# EAGLE design GPU (EAGLE 9.3.2)
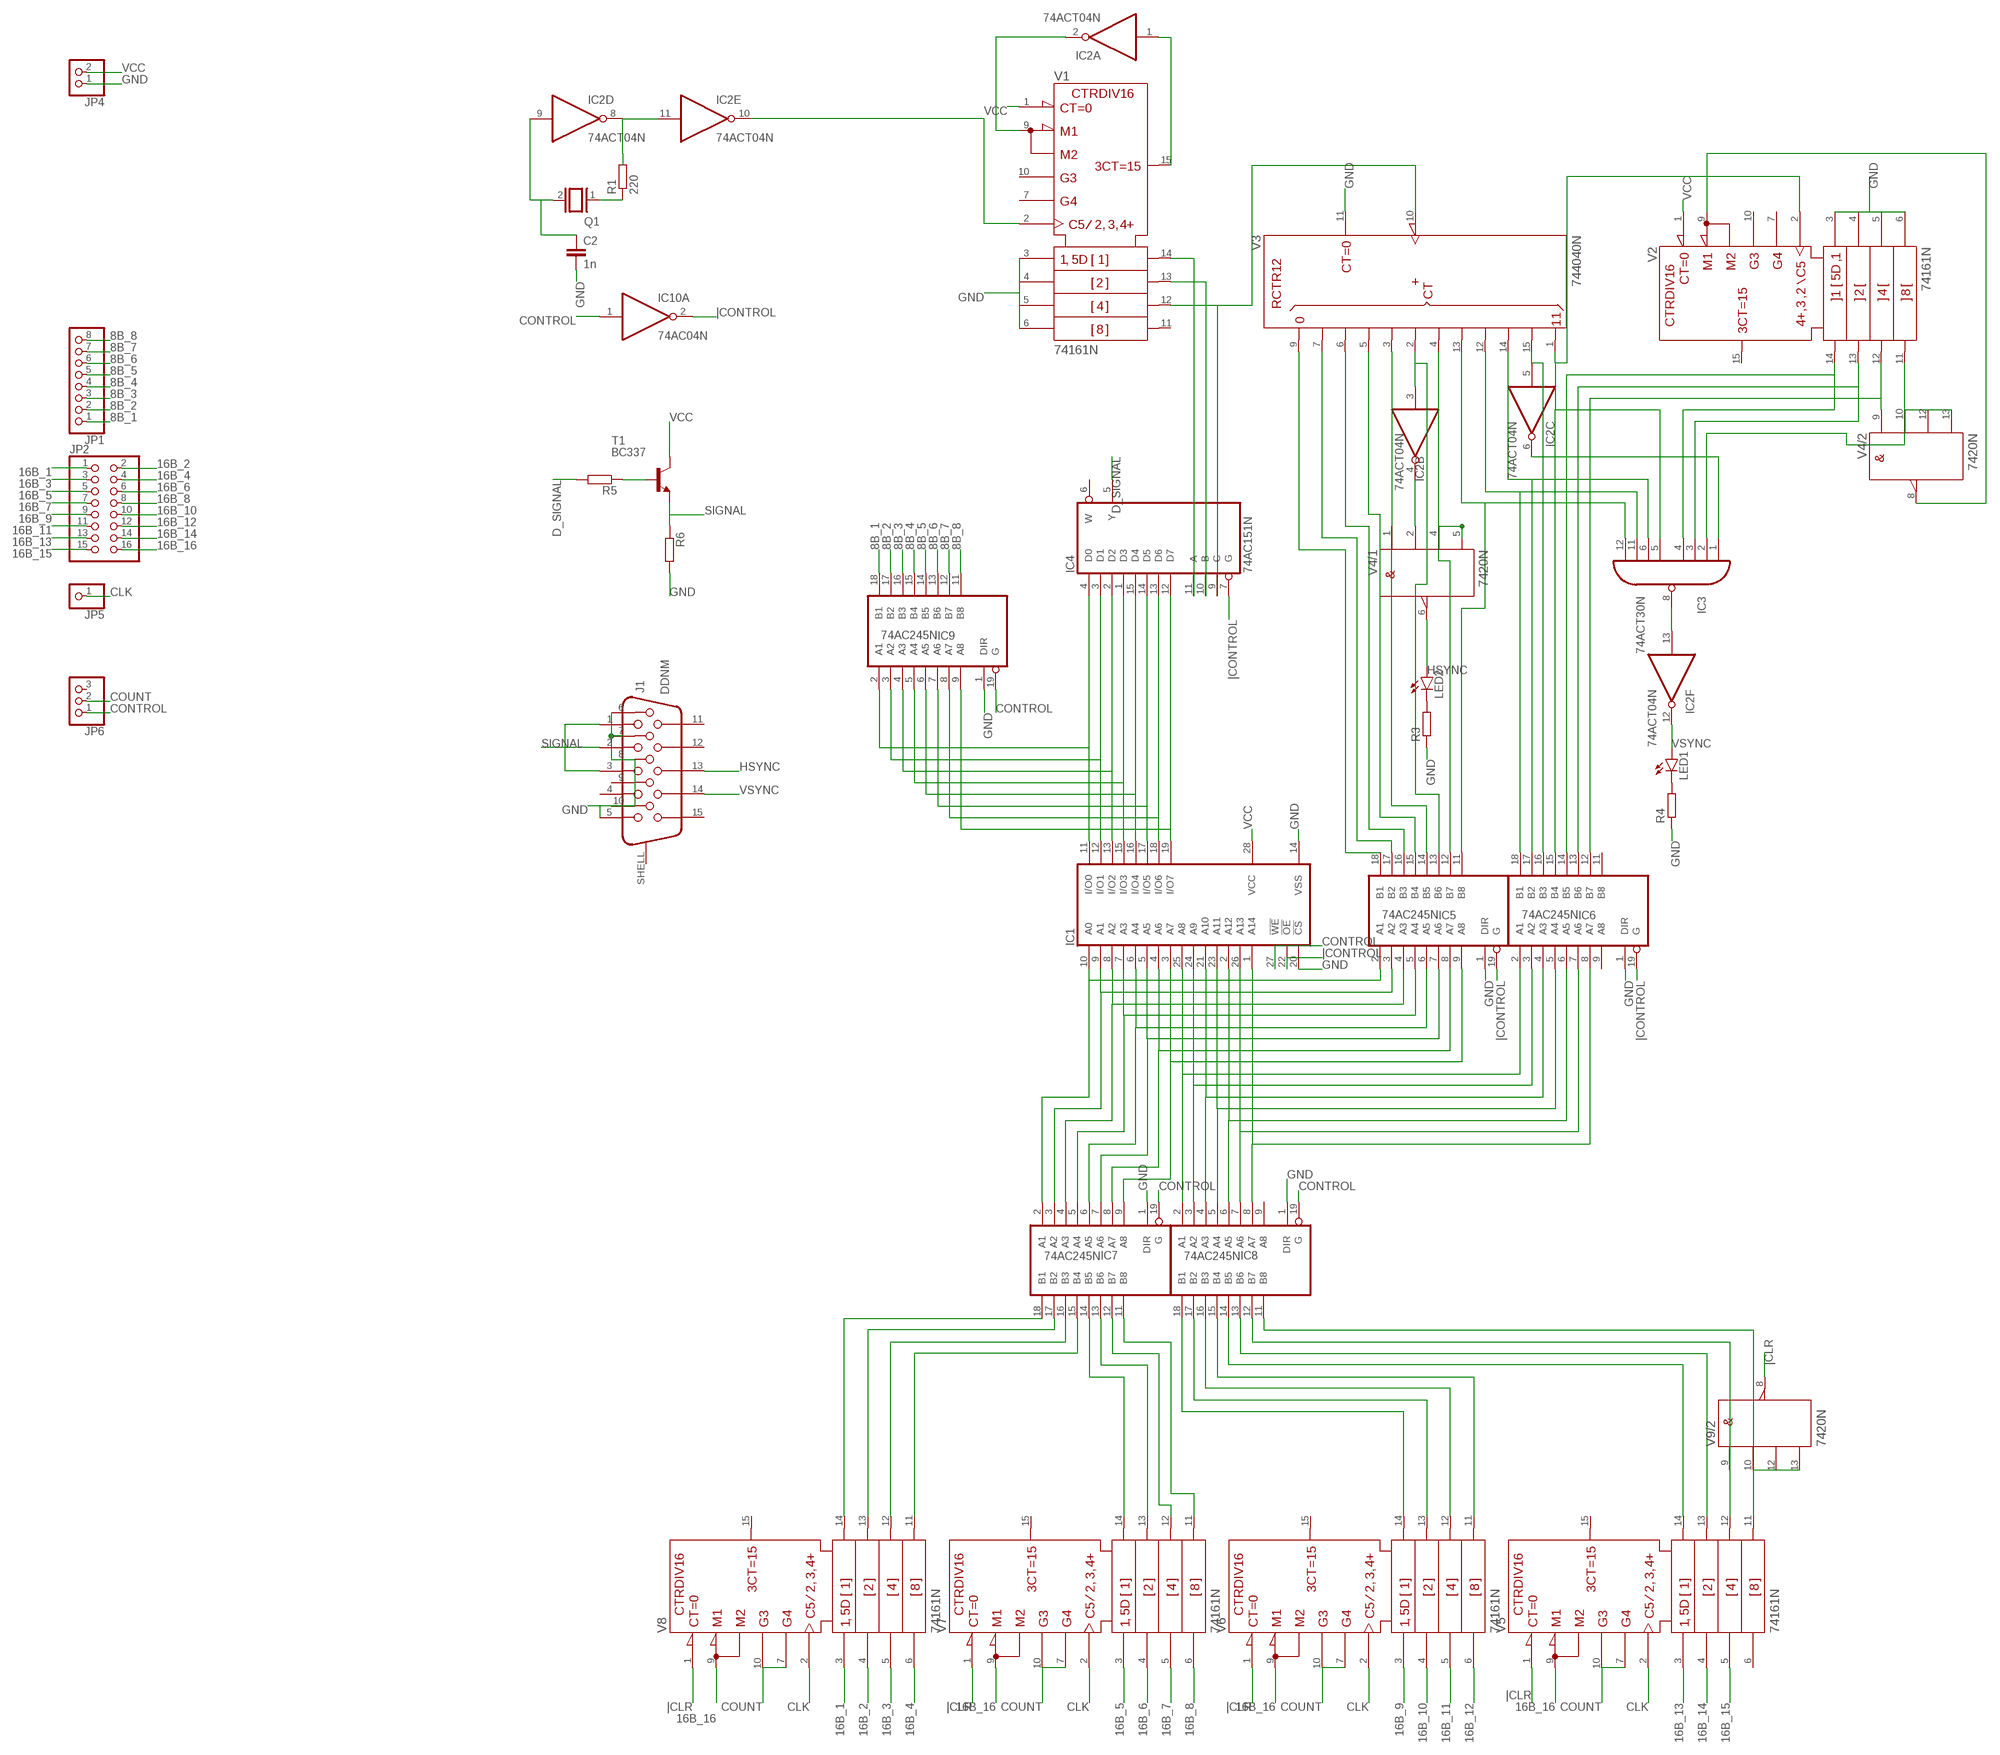
[diagram p0: schematic, sheet 1]

## Parts
C2  1n  C-EU025-025X050  [C025-025X050]
IC1  62256P  [DIL28-6]
IC2  74ACT04N  [DIL14]
IC3  74ACT30N  [DIL14]
IC4  74AC151N  [DIL16]
IC5  74AC245N  [DIL20]
IC6  74AC245N  [DIL20]
IC7  74AC245N  [DIL20]
IC8  74AC245N  [DIL20]
IC9  74AC245N  [DIL20]
IC10  74AC04N  [DIL14]
J1  DDNM  [DNM]
JP1  PINHD-1X8  [1X08]
JP2  PINHD-2X8  [2X08]
JP4  PINHD-1X2  [1X02]
JP5  PINHD-1X1  [1X01]
JP6  PINHD-1X3  [1X03]
LED1  LED5MM  [LED5MM]
LED2  LED5MM  [LED5MM]
Q1  XTAL/S  [QS]
R1  220  R-EU_0204/7  [0204/7]
R3  R-EU_0204/7  [0204/7]
R4  R-EU_0204/7  [0204/7]
R5  R-EU_0204/7  [0204/7]
R6  R-EU_0204/7  [0204/7]
T1  BC337  [TO92]
V1  74161N  [DIL16]
V2  74161N  [DIL16]
V3  744040N  [DIL16]
V4  7420N  [DIL14]
V5  74161N  [DIL16]
V6  74161N  [DIL16]
V7  74161N  [DIL16]
V8  74161N  [DIL16]
V9  7420N  [DIL14]

## Nets
8B_1: IC9.18(B1) JP1.1
8B_2: IC9.17(B2) JP1.2
8B_3: IC9.16(B3) JP1.3
8B_4: IC9.15(B4) JP1.4
8B_5: IC9.14(B5) JP1.5
8B_6: IC9.13(B6) JP1.6
8B_7: IC9.12(B7) JP1.7
8B_8: IC9.11(B8) JP1.8
16B_1: JP2.1 V8.3(A)
16B_2: JP2.2 V8.4(B)
16B_3: JP2.3 V8.5(C)
16B_4: JP2.4 V8.6(D)
16B_5: JP2.5 V7.3(A)
16B_6: JP2.6 V7.4(B)
16B_7: JP2.7 V7.5(C)
16B_8: JP2.8 V7.6(D)
16B_9: JP2.9 V6.3(A)
16B_10: JP2.10 V6.4(B)
16B_11: JP2.11 V6.5(C)
16B_12: JP2.12 V6.6(D)
16B_13: JP2.13 V5.3(A)
16B_14: JP2.14 V5.4(B)
16B_15: JP2.15 V5.5(C)
16B_16: JP2.16 V5.9(!LOAD) V6.9(!LOAD) V7.9(!LOAD) V8.9(!LOAD)
CLK: JP5.1 V5.2(CLK) V6.2(CLK) V7.2(CLK) V8.2(CLK)
CONTROL: IC1.27(!WE) IC7.19(G) IC8.19(G) IC9.19(G) IC10.1(A:I) JP6.1
COUNT: JP6.2 V5.7(ENP) V5.10(ENT) V6.7(ENP) V6.10(ENT) V7.7(ENP) V7.10(ENT) V8.7(ENP) V8.10(ENT)
D_SIGNAL: IC4.5(Y) R5.2
GND: C2.2 IC1.14(VSS) IC1.20(!CS) IC5.1(DIR) IC6.1(DIR) IC7.1(DIR) IC8.1(DIR) IC9.1(DIR) J1.5 J1.6 J1.7 J1.8 J1.10 JP4.1 R3.1 R4.1 R6.2 V1.3(A) V1.4(B) V1.5(C) V1.6(D) V2.3(A) V2.4(B) V2.5(C) V2.6(D) V3.11(CLR)
HSYNC: J1.13 LED2.A V4.6(/1:Y)
N$1: C2.1 IC2.9(D:I) Q1.2
N$3: Q1.1 R1.1
N$4: IC2.10(E:O) V1.2(CLK)
N$5: IC2.2(A:O) V1.9(!LOAD)
N$6: IC4.9(C) V1.12(QC) V3.10(CLK)
N$7: IC2.1(A:I) V1.15(RCO)
N$8: IC5.18(B1) V3.9(QA)
N$9: IC5.17(B2) V3.7(QB)
N$10: IC5.14(B5) V3.3(QE) V4.1(/1:A)
N$11: IC5.12(B7) V3.4(QG) V4.4(/1:C) V4.5(/1:D)
N$12: IC3.5(I4) IC6.15(B4) V2.2(CLK) V3.1(QL)
N$13: IC3.12(I7) IC5.11(B8) V3.13(QH)
N$14: V2.9(!LOAD) V4.8(/2:Y)
N$15: IC1.10(A0) IC5.2(A1) IC7.2(A1)
N$16: IC3.2(I1) V2.11(QD) V4.10(/2:B) V4.12(/2:C) V4.13(/2:D)
N$17: IC3.11(I6) IC6.18(B1) V3.12(QI)
N$18: IC3.6(I5) IC6.17(B2) V3.14(QJ)
N$19: IC3.4(I3) IC6.14(B5) V2.14(QA)
N$20: IC3.3(I2) IC6.13(B6) V2.13(QB)
N$21: IC2.5(C:I) IC6.16(B3) V3.15(QK)
N$22: IC2.6(C:O) IC3.1(I0)
N$23: IC2.13(F:I) IC3.8(O)
N$24: IC4.11(A) V1.14(QA)
N$25: IC4.10(B) V1.13(QB)
N$26: IC5.16(B3) V3.6(QC)
N$27: R5.1 T1.2(B)
N$28: LED2.K(C) R3.2
N$29: LED1.K(C) R4.2
N$30: IC2.8(D:O) IC2.11(E:I) R1.2
N$35: IC5.15(B4) V3.5(QD)
N$36: IC1.9(A1) IC5.3(A2) IC7.3(A2)
N$37: IC1.8(A2) IC5.4(A3) IC7.4(A3)
N$38: IC1.7(A3) IC5.5(A4) IC7.5(A4)
N$39: IC2.4(B:O) V4.2(/1:B)
N$40: IC1.6(A4) IC5.6(A5) IC7.6(A5)
N$41: IC6.12(B7) V2.12(QC) V4.9(/2:A)
N$42: IC1.5(A5) IC5.7(A6) IC7.7(A6)
N$43: IC1.4(A6) IC5.8(A7) IC7.8(A7)
N$44: IC2.3(B:I) IC5.13(B6) V3.2(QF)
N$45: IC1.3(A7) IC5.9(A8) IC7.9(A8)
N$46: IC1.25(A8) IC6.2(A1) IC8.2(A1)
N$47: IC1.24(A9) IC6.3(A2) IC8.3(A2)
N$48: IC1.21(A10) IC6.4(A3) IC8.4(A3)
N$49: IC1.23(A11) IC6.5(A4) IC8.5(A4)
N$50: IC1.2(A12) IC6.6(A5) IC8.6(A5)
N$51: IC1.26(A13) IC6.7(A6) IC8.7(A6)
N$52: IC1.1(A14) IC6.8(A7) IC8.8(A7)
N$53: IC8.12(B7) V5.12(QC) V9.9(/2:A)
N$54: IC8.11(B8) V5.11(QD) V9.10(/2:B) V9.12(/2:C) V9.13(/2:D)
N$55: IC7.18(B1) V8.14(QA)
N$56: IC7.17(B2) V8.13(QB)
N$57: IC7.16(B3) V8.12(QC)
N$58: IC7.15(B4) V8.11(QD)
N$59: IC7.14(B5) V7.14(QA)
N$60: IC7.13(B6) V7.13(QB)
N$61: IC7.12(B7) V7.12(QC)
N$62: IC7.11(B8) V7.11(QD)
N$63: IC8.18(B1) V6.14(QA)
N$64: IC8.13(B6) V5.13(QB)
N$65: IC8.14(B5) V5.14(QA)
N$66: IC8.15(B4) V6.11(QD)
N$67: IC8.16(B3) V6.12(QC)
N$68: IC8.17(B2) V6.13(QB)
N$71: IC1.19(I/O7) IC4.12(D7) IC9.9(A8)
N$72: IC1.17(I/O5) IC4.14(D5) IC9.7(A6)
N$73: IC1.18(I/O6) IC4.13(D6) IC9.8(A7)
N$74: IC1.16(I/O4) IC4.15(D4) IC9.6(A5)
N$75: IC1.15(I/O3) IC4.1(D3) IC9.5(A4)
N$76: IC1.13(I/O2) IC4.2(D2) IC9.4(A3)
N$77: IC1.12(I/O1) IC4.3(D1) IC9.3(A2)
N$78: IC1.11(I/O0) IC4.4(D0) IC9.2(A1)
SIGNAL: J1.1 J1.2 J1.3 R6.1 T1.1(E)
VCC: IC1.28(VCC) JP4.2 T1.3(C) V1.1(!CLR) V2.1(!CLR)
VSYNC: IC2.12(F:O) J1.14 LED1.A
|CLR: V5.1(!CLR) V6.1(!CLR) V7.1(!CLR) V8.1(!CLR) V9.8(/2:Y)
|CONTROL: IC1.22(!OE) IC4.7(G) IC5.19(G) IC6.19(G) IC10.2(A:O)
Unconnected: IC4.6(W) IC6.9(A8) IC6.11(B8) IC8.9(A8) IC10.3(B:I) IC10.4(B:O) IC10.5(C:I) IC10.6(C:O) IC10.8(D:O) IC10.9(D:I) IC10.10(E:O) IC10.11(E:I) IC10.12(F:O) IC10.13(F:I) J1.4 J1.9 J1.11 J1.12 J1.15 J1.SHELL(SHIELD) JP6.3 V1.7(ENP) V1.10(ENT) V1.11(QD) V2.7(ENP) V2.10(ENT) V2.15(RCO) V5.6(D) V5.15(RCO) V6.15(RCO) V7.15(RCO) V8.15(RCO) V9.1(/1:A) V9.2(/1:B) V9.4(/1:C) V9.5(/1:D) V9.6(/1:Y)

## Power pins joined to a net without a drawn wire
+UB: V1.16(+UB) V2.16(+UB) V3.16(+UB) V4.14(/+UB:+UB) V5.16(+UB) V6.16(+UB) V7.16(+UB) V8.16(+UB) V9.14(/+UB:+UB)
-UB: V1.8(-UB) V2.8(-UB) V3.8(-UB) V4.7(/-UB:-UB) V5.8(-UB) V6.8(-UB) V7.8(-UB) V8.8(-UB) V9.7(/-UB:-UB)
GND: IC2.7(P:GND) IC3.7(GND) IC4.8(GND) IC5.10(GND) IC6.10(GND) IC7.10(GND) IC8.10(GND) IC9.10(GND) IC10.7(P:GND)
VCC: IC2.14(P:VCC) IC3.14(VCC) IC4.16(VCC) IC5.20(VCC) IC6.20(VCC) IC7.20(VCC) IC8.20(VCC) IC9.20(VCC) IC10.14(P:VCC)

## Library data of the parts
C2 = resistor:C-EU: CAPACITOR, European symbol
IC1 = memory-hitachi:62256P: MEMORY; OC_FARNELL: unknown; OC_NEWARK: unknown
IC2 IC10 = 74xx-eu:74*04: Hex INVERTER
IC3 = 74xx-eu:74*30: 8-input NAND gate
IC4 = 74xx-eu:74*151: Data SELECTOR/MULTIPLEXER
IC5-IC9 = 74xx-eu:74*245: Octal BUS TRANSCEIVER, 3-state
J1 = untitled:DDNM; SPICEPREFIX: X
JP1 = pinhead:PINHD-1X8: PIN HEADER
JP2 = pinhead:PINHD-2X8: PIN HEADER
JP4 = pinhead:PINHD-1X2: PIN HEADER
JP5 = pinhead:PINHD-1X1: PIN HEADER
JP6 = pinhead:PINHD-1X3: PIN HEADER
LED1 LED2 = led:LED: LED OSRAM: - CHIPLED LG R971, LG N971, LY N971, LG Q971, LY Q971, LO R971, LY R971 LH N974, LH R974 LS Q976, LO Q976, LY Q976 LO Q996 - Hyper CHIPLED LW Q18S LB Q993, LB Q99A, LB R99A - SideLED LS A670, LO A670, LY A670, LG A670, LP A670 LB A673, LV A673, LT A673, LW A673 LH A674 LY A675 LS A676, LA A676, LO A676, LY A676, LW A676 LS A679, LY A679, LG A679 - Hyper Micro SIDELED® LS Y876, LA Y876, LO Y876, LY Y876 LT Y87S - SmartLED LW L88C, LW L88S LB L89C, LB L89S, LG L890 LS L89K, LO L89K, LY L89K LS L896, LA L896, LO L896, LY L896 - TOPLED LS T670, LO T670, LY T670, LG T670, LP T670 LSG T670, LSP T670, LSY T670, LOP T670, LYG T670 LG T671, LOG T671, LSG T671 LB T673, LV T673, LT T673, LW T673 LH T674 LS T676, LA T676, LO T676, LY T676, LB T676, LH T676, LSB T676, LW T676 LB T67C, LV T67C, LT T67C, LS T67K, LO T67K, LY T67K, LW E67C LS E67B, LA E67B, LO E67B, LY E67B, LB E67C, LV E67C, LT E67C LW T67C LS T679, LY T679, LG T679 LS T770, LO T770, LY T770, LG T770, LP T770 LB T773, LV T773, LT T773, LW T773 LH T774 LS E675, LA E675, LY E675, LS T675 LS T776, LA T776, LO T776, LY T776, LB T776 LHGB T686 LT T68C, LB T68C - Hyper Mini TOPLED® LB M676 - Mini TOPLED Santana® LG M470 LS M47K, LO M47K, LY M47K Source: http://www.osram.convergy.de LUXEON: - LUMILED® LXK2-PW12-R00, LXK2-PW12-S00, LXK2-PW14-U00, LXK2-PW14-V00 LXK2-PM12-R00, LXK2-PM12-S00, LXK2-PM14-U00 LXK2-PE12-Q00, LXK2-PE12-R00, LXK2-PE12-S00, LXK2-PE14-T00, LXK2-PE14-U00 LXK2-PB12-K00, LXK2-PB12-L00, LXK2-PB12-M00, LXK2-PB14-N00, LXK2-PB14-P00, LXK2-PB14-Q00 LXK2-PR12-L00, LXK2-PR12-M00, LXK2-PR14-Q00, LXK2-PR14-R00 LXK2-PD12-Q00, LXK2-PD12-R00, LXK2-PD12-S00 LXK2-PH12-R00, LXK2-PH12-S00 LXK2-PL12-P00, LXK2-PL12-Q00, LXK2-PL12-R00 Source: www.luxeon.com KINGBRIGHT: KA-3528ASYC Source: www.kingbright.com
Q1 = special:XTAL/S: CRYSTAL
R1 R3 R4 = rcl:R-EU_: RESISTOR, European symbol; SPICEPREFIX: R
R5 R6 = resistor:R-EU_: RESISTOR, European symbol
T1 = transistor:BC337: NPN TRANSISTOR
V1 V2 V5-V8 = 74ttl-din:74*161: Synchrounus 4-bit COUNTER
V3 = 74ttl-din:74*4040: 12-bit asynchronous binary COUNTER
V4 V9 = 74ttl-din:74*20: Dual 4-input NAND gate

## Net classes
0 default: width 0.254 mm

## Board
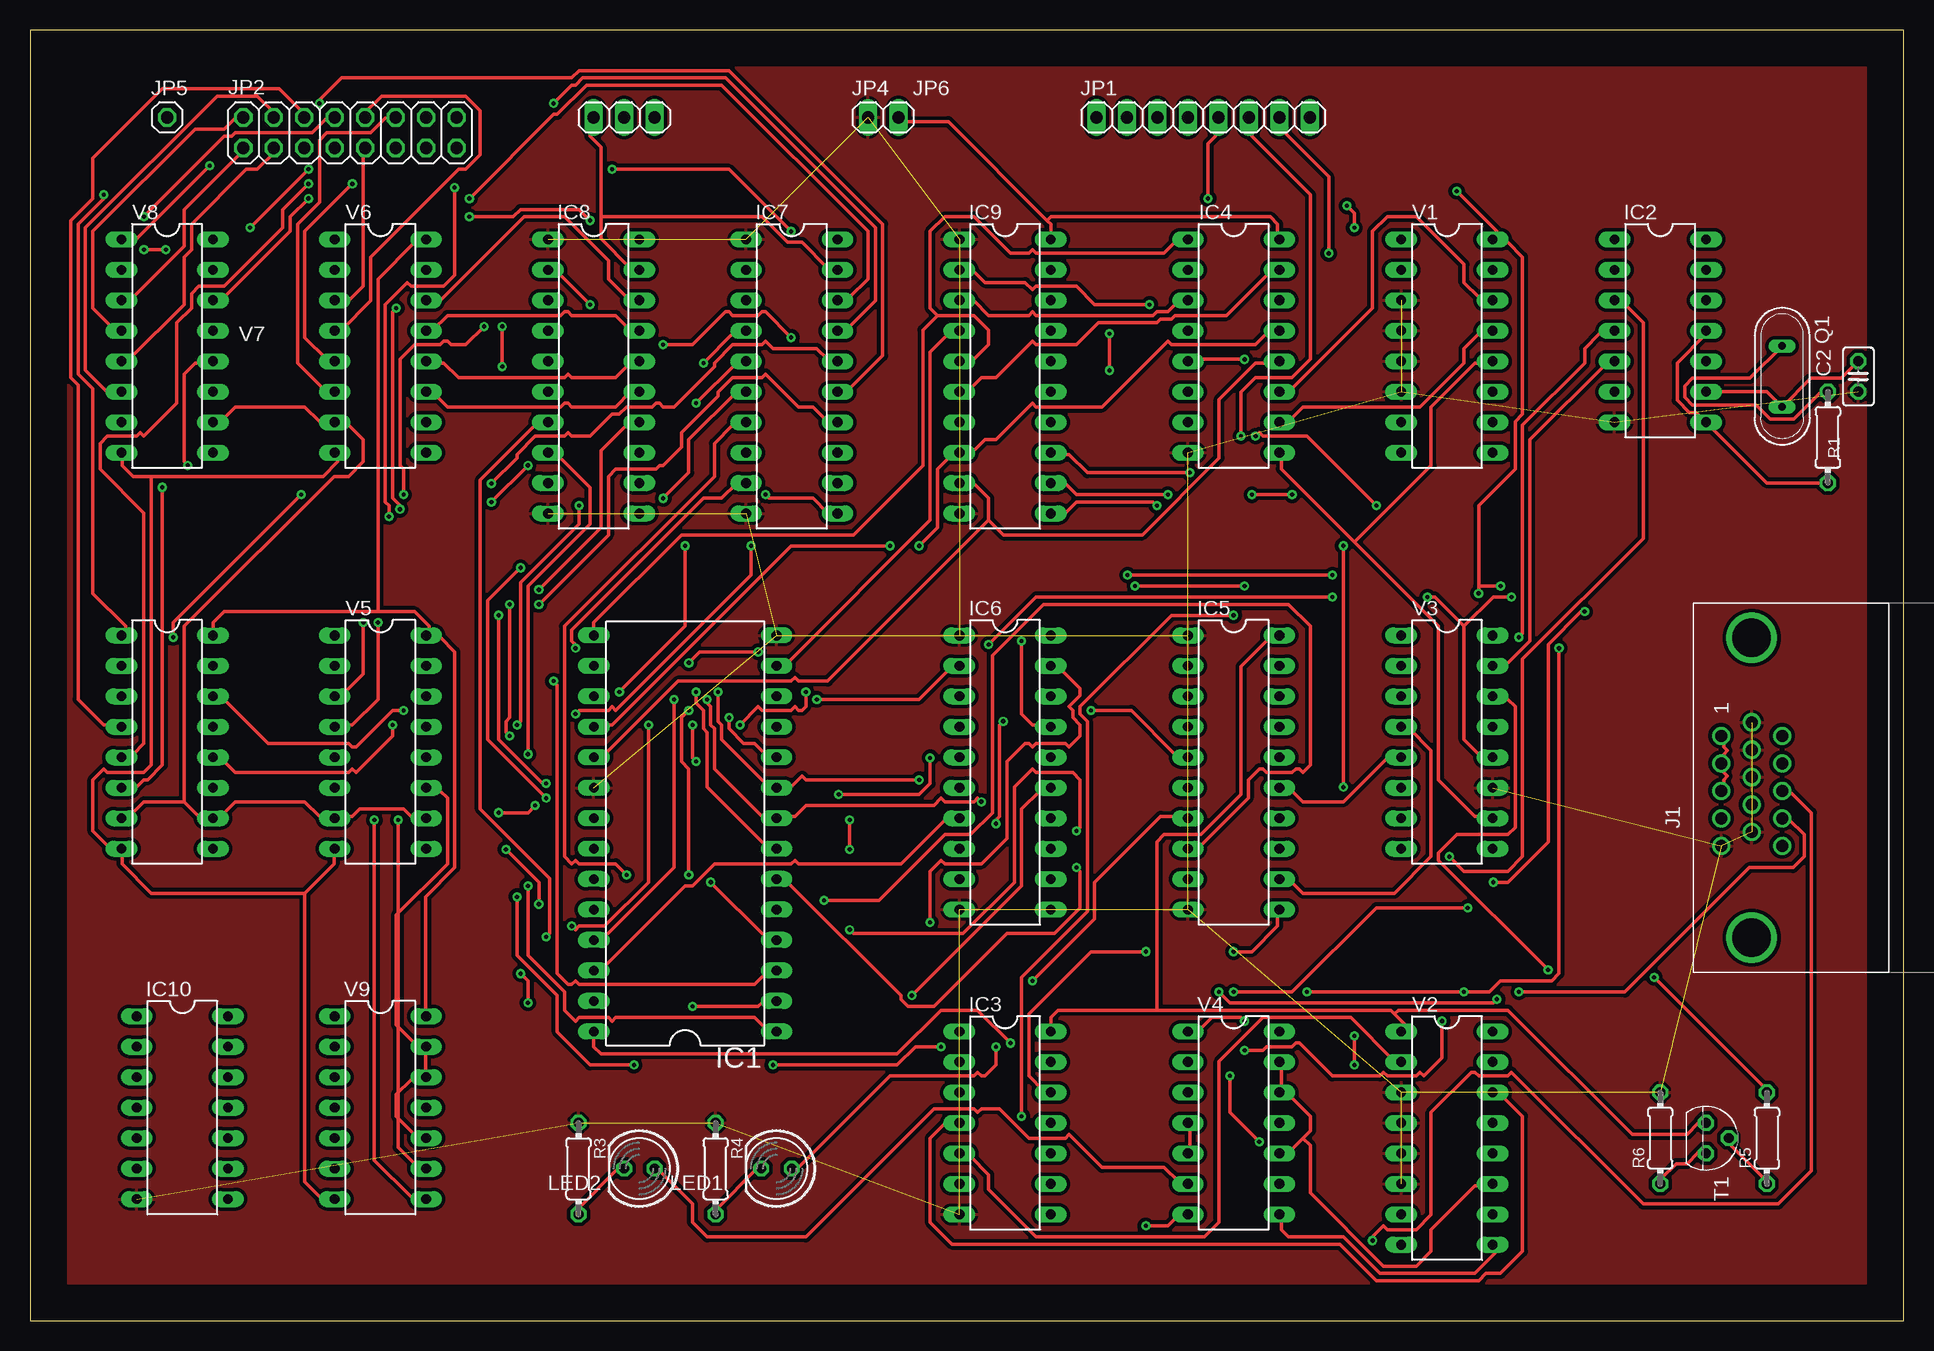
[diagram p1: board, top side]
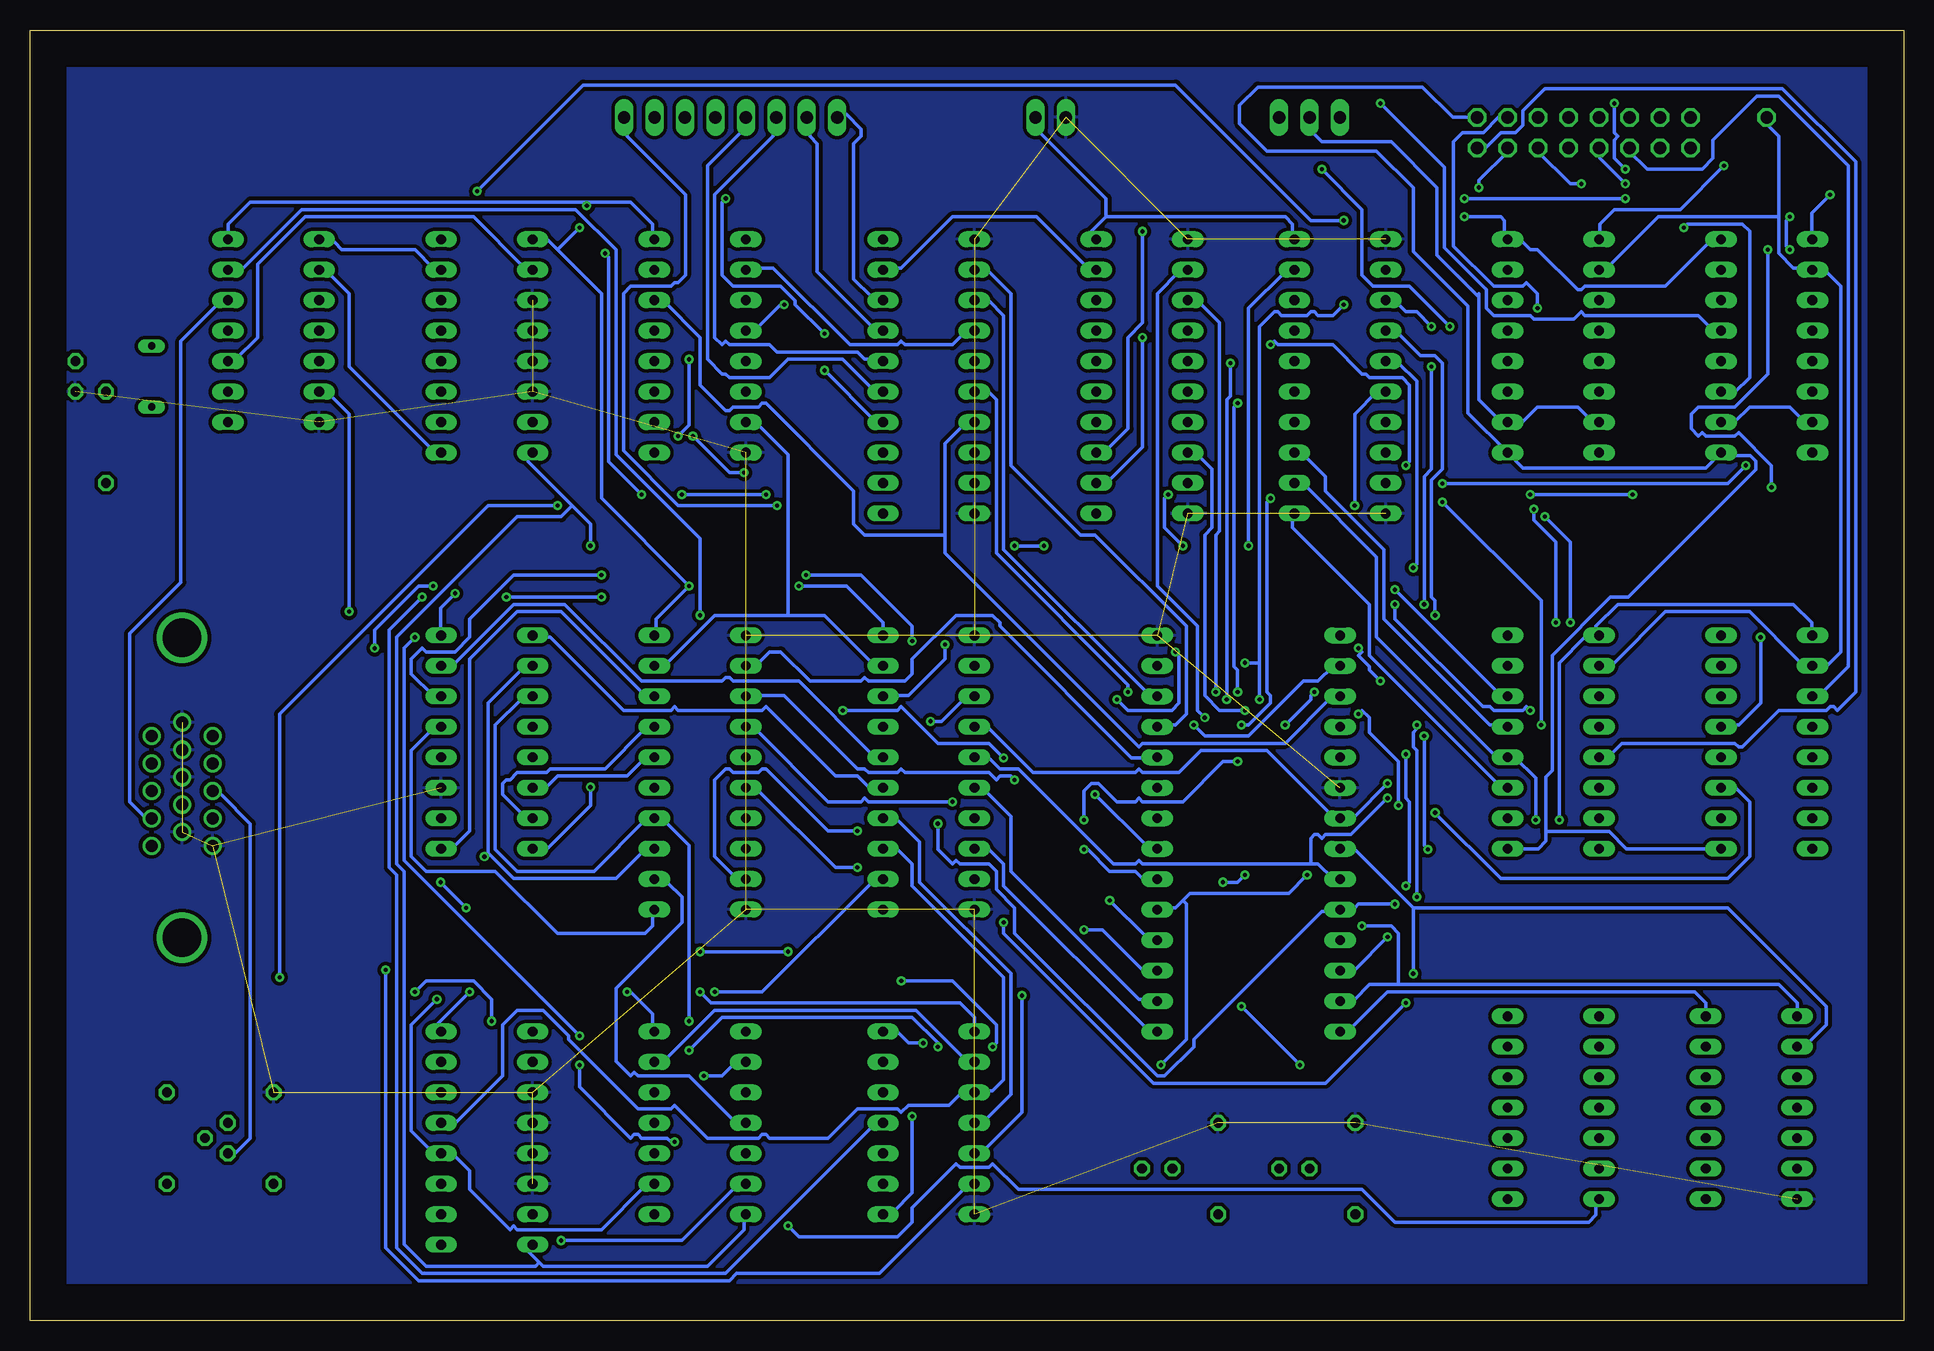
[diagram p2: board, bottom side, seen from below]

Size 156.19 x 107.62 mm. Coordinates in mm from the lower left corner, seen from the top.
Outline: 0,0 156.19,0 156.19,107.62 0,107.62 0,0
Copper layers (1*16): Top 0.035mm / dielectric 1.5mm / Bottom 0.035mm
Design rules "Endustriyel": minimum track width 12mil, minimum drill 0.35mm, track to track 12mil, track to pad 12mil, pad to pad 12mil, via to via 12mil, smd to smd 6mil, copper to edge 120mil, drill to drill 12mil, minimum pad ring 10mil, minimum via ring 8mil, stop-mask expansion 4mil, vias tented up to drill 0mil, thermal gap 10mil

### Footprints (pad centres in the part's own frame; a part is rotated, then mirrored left to right if it is on the bottom)
C025-025X050 = drill 0.813 octagon: 1 -1.27,0; 2 1.27,0
DIL28-6 = drill 0.813 long: 1 -16.51,-7.62; 2 -13.97,-7.62; 3 -11.43,-7.62; 4 -8.89,-7.62; 5 -6.35,-7.62; 6 -3.81,-7.62; 7 -1.27,-7.62; 8 1.27,-7.62; 9 3.81,-7.62; 10 6.35,-7.62; 11 8.89,-7.62; 12 11.43,-7.62; 13 13.97,-7.62; 14 16.51,-7.62; 15 16.51,7.62; 16 13.97,7.62; 17 11.43,7.62; 18 8.89,7.62; 19 6.35,7.62; 20 3.81,7.62; 21 1.27,7.62; 22 -1.27,7.62; 23 -3.81,7.62; 24 -6.35,7.62; 25 -8.89,7.62; 26 -11.43,7.62; 27 -13.97,7.62; 28 -16.51,7.62
DIL14 = drill 0.813 long: 1 -7.62,-3.81; 2 -5.08,-3.81; 3 -2.54,-3.81; 4 0,-3.81; 5 2.54,-3.81; 6 5.08,-3.81; 7 7.62,-3.81; 8 7.62,3.81; 9 5.08,3.81; 10 2.54,3.81; 11 0,3.81; 12 -2.54,3.81; 13 -5.08,3.81; 14 -7.62,3.81
DIL16 = drill 0.813 long: 1 -8.89,-3.81; 2 -6.35,-3.81; 3 -3.81,-3.81; 4 -1.27,-3.81; 5 1.27,-3.81; 6 3.81,-3.81; 7 6.35,-3.81; 8 8.89,-3.81; 9 8.89,3.81; 10 6.35,3.81; 11 3.81,3.81; 12 1.27,3.81; 13 -1.27,3.81; 14 -3.81,3.81; 15 -6.35,3.81; 16 -8.89,3.81
DIL20 = drill 0.813 long: 1 -11.43,-3.81; 2 -8.89,-3.81; 3 -6.35,-3.81; 4 -3.81,-3.81; 5 -1.27,-3.81; 6 1.27,-3.81; 7 3.81,-3.81; 8 6.35,-3.81; 9 8.89,-3.81; 10 11.43,-3.81; 11 11.43,3.81; 12 8.89,3.81; 13 6.35,3.81; 14 3.81,3.81; 15 1.27,3.81; 16 -1.27,3.81; 17 -3.81,3.81; 18 -6.35,3.81; 19 -8.89,3.81; 20 -11.43,3.81
DNM = drill 1: 1 4.32,2.54; 2 2.03,2.54; 3 -0.26,2.54; 4 -2.55,2.54; 5 -4.84,2.54; 6 5.46,0; 7 3.17,0; 8 0.88,0; 9 -1.41,0; 10 -3.7,0; 11 4.32,-2.54; 12 2.03,-2.54; 13 -0.26,-2.54; 14 -2.55,-2.54; 15 -4.84,-2.54 | drill 3.2: SHELL -12.5,0; SHELL1 12.5,0
1X08 = drill 1.016 long: 1 -8.89,0; 2 -6.35,0; 3 -3.81,0; 4 -1.27,0; 5 1.27,0; 6 3.81,0; 7 6.35,0; 8 8.89,0
2X08 = drill 1.016 octagon: 1 -8.89,-1.27; 2 -8.89,1.27; 3 -6.35,-1.27; 4 -6.35,1.27; 5 -3.81,-1.27; 6 -3.81,1.27; 7 -1.27,-1.27; 8 -1.27,1.27; 9 1.27,-1.27; 10 1.27,1.27; 11 3.81,-1.27; 12 3.81,1.27; 13 6.35,-1.27; 14 6.35,1.27; 15 8.89,-1.27; 16 8.89,1.27
1X02 = drill 1.016 long: 1 -1.27,0; 2 1.27,0
1X01 = drill 1.016 octagon: 1 0,0
1X03 = drill 1.016 long: 1 -2.54,0; 2 0,0; 3 2.54,0
LED5MM = drill 0.813 octagon: A -1.27,0; K 1.27,0
QS = drill 0.61 long: 1 -2.54,0; 2 2.54,0
0204/7 = drill 0.813 octagon: 1 -3.81,0; 2 3.81,0
TO92 = drill 0.813 octagon: 1 1.27,0; 2 0,1.905; 3 -1.27,0

### Placement (x,y rotation side)
C2  152.4,78.74 270 top
IC1  54.61,40.64 90 top
IC2  135.89,82.55 270 top
IC3  81.28,16.51 270 top
IC4  100.33,81.28 270 top
IC5  100.33,45.72 270 top
IC6  81.28,45.72 270 top
IC7  63.5,78.74 270 top
IC8  46.99,78.74 270 top
IC9  81.28,78.74 270 top
IC10  12.7,17.78 270 top
J1  143.51,44.45 90 top
JP1  97.79,100.33 0 top
JP2  26.67,99.06 0 top
JP4  71.12,100.33 0 top
JP5  11.43,100.33 0 top
JP6  49.53,100.33 0 top
LED1  62.23,12.7 180 top
LED2  50.8,12.7 180 top
Q1  146.05,78.74 270 top
R1  149.86,73.66 270 top
R3  45.72,12.7 270 top
R4  57.15,12.7 270 top
R5  144.78,15.24 90 top
R6  135.89,15.24 90 top
T1  139.7,15.24 270 top
V1  118.11,81.28 270 top
V2  118.11,15.24 270 top
V3  118.11,48.26 270 top
V4  100.33,16.51 270 top
V5  29.21,48.26 270 top
V6  29.21,81.28 270 top
V7  11.43,48.26 270 top
V8  11.43,81.28 270 top
V9  29.21,17.78 270 top

### Tracks (layer width: path | path; a pad name or v marks a point on that pad's centre or on a via)
8B_1
  Bottom 0.305: IC9.18 85.09,85.34 86,85.34 87.53,86.87 87.53,98.15 86.92,98.76 86.92,99.37 88.14,100.58 88.75,100.58 JP1.1
8B_2
  Bottom 0.305: IC9.17 85.09,82.6 85.7,82.6 90.58,87.48 90.58,98.15 91.19,98.76 91.19,100.28 JP1.2
8B_3
  Bottom 0.305: IC9.16 85.09,80.16 86.61,80.16 87.22,80.77 93.93,80.77 94.54,81.38 97.89,81.38 98.2,81.69 98.5,81.38 99.11,81.99 99.11,93.88 94.23,98.76 94.23,100.28 JP1.3
8B_4
  Bottom 0.305: IC9.15 85.09,77.72 86,77.72 88.44,80.16 93.02,80.16 94.54,78.64 97.89,78.64 98.2,78.94 98.5,78.94 99.72,80.16 99.72,96.32 96.67,99.37 96.67,100.28 JP1.4
8B_5  (via drill 0.35)
  Top 0.305: v89.97,82.3 v89.97,79.25 | v98.2,93.57 98.2,98.15 98.81,98.76 98.81,100.28 JP1.5
  Bottom 0.305: v89.97,79.25 85.7,74.98 85.09,74.98 IC9.14 | v89.97,82.3 92.41,84.73 92.41,85.04 93.62,86.26 97.59,86.26 98.5,87.17 98.5,93.27 v98.2,93.57
8B_6  (via drill 0.35)
  Top 0.305: v96.67,70.71 88.14,70.71 86.61,72.24 85.09,72.24 IC9.13 | v100.94,73.76 100.94,77.42 102.16,78.64 105.21,78.64 106.73,80.16 106.73,93.88 101.85,98.76 101.85,100.28 JP1.6
  Bottom 0.305: v96.67,70.71 97.89,70.71 v100.94,73.76
8B_7  (via drill 0.35)
  Top 0.305: v94.84,68.89 87.22,68.89 86.31,69.8 85.09,69.8 IC9.12 | v105.21,68.89 v101.85,68.89 | v108.26,89 108.26,95.4 104.29,99.37 104.29,100.28 JP1.7
  Bottom 0.305: v101.85,68.89 v94.84,68.89 | v105.21,68.89 107.95,71.63 107.95,88.7 v108.26,89
8B_8  (via drill 0.35)
  Top 0.305: v93.93,67.97 93.62,68.28 87.22,68.28 86.31,67.36 85.09,67.36 IC9.11
  Bottom 0.305: v93.93,67.97 102.16,67.97 106.73,72.54 106.73,85.65 106.12,86.26 102.77,86.26 102.46,86.56 102.16,86.56 101.55,87.17 101.55,93.88 106.43,98.76 106.43,100.28 JP1.8
16B_1
  Top 0.305: V8.3 7.67,85.34 8.59,85.34 12.85,89.61 12.85,92.66 17.42,97.23 17.42,97.54 17.73,97.84 JP2.1
16B_2
  Top 0.305: V8.4 7.37,82.6 7.06,82.6 5.23,84.43 5.23,90.83 13.77,99.37 16.2,99.37 17.12,100.28 17.73,100.28 JP2.2
16B_3
  Top 0.305: V8.5 7.67,80.16 8.28,80.16 12.85,84.73 12.85,88.7 13.46,89.31 13.46,91.44 18.03,96.01 18.95,96.01 20.47,97.54 JP2.3
16B_4
  Top 0.305: V8.6 7.37,77.42 6.45,77.42 4.62,79.25 4.62,91.14 15.6,102.11 18.95,102.11 20.47,100.58 JP2.4
16B_5
  Bottom 0.305: V7.3 7.37,52.12 7.06,52.12 4.62,54.56 4.62,96.32 10.41,102.11 12.24,102.11 15.9,98.45 15.9,96.93 16.81,96.01 21.39,96.01 22.91,97.54 JP2.5
16B_6
  Top 0.305: V7.4 7.37,49.68 6.15,49.68 4.01,51.82 4.01,78.03 3.4,78.64 3.4,91.75 5.23,93.57 5.23,96.93 11.02,102.72 20.78,102.72 22.91,100.58 JP2.6
16B_7  (via drill 0.35)
  Top 0.305: v23.22,94.79 21.08,92.66 21.08,91.14 16.2,86.26 14.07,86.26 13.46,85.65 13.46,84.43 12.24,83.21 12.24,76.51 9.5,73.76 9.2,74.07 8.89,73.76 6.45,73.76 5.84,73.15 5.84,71.02 9.5,67.36 9.5,48.16 8.59,47.24 7.67,47.24 V7.5
  Bottom 0.305: v23.22,94.79 25.35,96.93 25.35,97.54 JP2.7
16B_8  (via drill 0.35)
  Top 0.305: v11.02,69.49 11.02,46.33 9.8,45.11 9.5,45.11 8.89,44.5 7.67,44.5 V7.6 | v9.5,89.31 v11.33,89.31 | v9.5,92.05 16.2,98.76 16.81,98.76 17.12,99.06 23.52,99.06 24.74,100.28 25.35,100.28 JP2.8
  Bottom 0.305: v11.02,69.49 11.02,71.32 13.77,74.07 14.07,73.76 16.51,73.76 16.81,74.07 17.12,73.76 17.73,74.37 17.73,75.59 17.12,76.2 14.07,76.2 11.33,78.94 v11.33,89.31 | v9.5,89.31 9.8,89.61 9.8,91.75 v9.5,92.05
16B_9
  Top 0.305: V6.3 25.65,85.04 26.57,85.04 27.79,86.26 27.79,97.54 JP2.9
16B_10
  Top 0.305: V6.4 25.65,82.6 25.96,82.6 28.4,85.04 28.4,88.7 35.71,96.01 36.32,96.01 37.54,97.23 37.54,100.89 36.32,102.11 29.31,102.11 27.79,100.58 JP2.10
16B_11  (via drill 0.35)
  Top 0.305: v26.87,94.79 22.91,90.83 22.91,81.99 24.74,80.16 25.35,80.16 V6.5
  Bottom 0.305: v26.87,94.79 27.79,94.79 30.53,97.54 JP2.11
16B_12
  Top 0.305: V6.6 25.35,77.72 24.44,77.72 22.3,79.86 22.3,91.44 24.13,93.27 24.13,98.45 24.74,99.06 28.4,99.06 29.62,100.28 30.23,100.28 JP2.12
16B_13  (via drill 0.35)
  Top 0.305: v27.79,58.22 27.79,53.95 25.96,52.12 25.65,52.12 V5.3 | v29.92,67.06 29.92,67.97 29.62,68.28 29.62,84.73 31.45,86.56 31.75,86.26 34.49,86.26 35.41,87.17 v35.41,94.49
  Bottom 0.305: v27.79,58.22 27.79,64.92 v29.92,67.06 | v35.41,94.49 35.41,95.1 32.97,97.54 JP2.13
16B_14  (via drill 0.35)
  Top 0.305: v29.01,58.22 29.01,51.82 26.87,49.68 25.65,49.68 V5.4 | v30.84,67.67 30.84,67.97 30.23,68.58 30.23,84.12 v30.53,84.43
  Bottom 0.305: v29.01,58.22 29.01,64.92 30.84,66.75 v30.84,67.67 | v30.53,84.43 30.53,85.65 31.45,86.56 31.75,86.26 34.19,86.26 37.54,89.61 37.54,98.3 36.78,99.06 35.05,99.06 33.78,100.33 JP2.14
16B_15
  Bottom 0.305: V5.5 25.35,47.24 24.44,47.24 23.52,48.16 14.07,48.16 13.77,47.85 13.46,47.85 10.41,50.9 6.45,50.9 6.15,51.21 5.84,51.21 5.54,50.9 4.01,52.43 4.01,96.62 10.11,102.72 29.92,102.72 31.75,100.89 31.75,99.67 32.36,99.06 33.58,99.06 34.8,97.84 35.41,97.84 JP2.15
16B_16
  Bottom 0.305: 29.85,40.79 29.85,45.34 29.31,45.87 29.31,55.48 24.44,60.35 22.95,60.35 12.32,70.98 12.32,71.67 12.81,72.16 15.01,72.16 V8.9 16.51,71.12 31.75,71.12 V6.9 36.32,75.69 36.32,84.58 40.89,89.15 40.89,94.49 43.94,97.54 53.09,97.54 55.37,99.82 55.37,101.35 53.85,102.87 40.13,102.87 37.59,100.33 JP2.16 | 29.85,40.79 29.85,40 30.48,39.37 V5.9 | 29.85,40.79 24.54,40.79 23.11,39.37 V7.9
+UB  (via drill 0.35)
  Top 0.305: V9.14 32.97,25.6 32.97,35.36 35.41,37.8 35.41,55.78 34.19,57 33.27,57 V5.16 33.27,57.3 33.27,57.91 32.05,59.13 29.01,59.13 | 29.01,59.13 16.2,59.13 15.29,58.22 15.29,57.3 V7.16 | 29.01,59.13 29.01,86.87 32.05,89.92 32.97,89.92 V6.16 | v106.43,27.43 v119.53,27.43 121.67,27.43 122.58,28.35 126.85,28.35 127.46,28.96 v127.46,56.08 | 120.75,61.27 120.75,67.97 123.8,71.02 123.8,74.98 124.41,75.59 124.41,88.7 123.19,89.92 122.28,89.92 | 120.75,61.27 v120.75,60.65 | 122.28,89.92 121.97,89.92 V1.16 122.28,89.92 | 120.75,61.27 v122.58,61.27 | v36.63,92.05 40.28,92.05 40.89,92.66 45.77,92.66 v46.68,91.75 | v118.92,94.18 122.28,90.83 122.28,89.92
  Bottom 0.305: V8.16 15.29,89.92 16.2,89.92 19.86,86.26 26.57,86.26 26.87,85.95 27.18,85.95 30.53,89.31 31.14,89.31 31.75,89.92 32.97,89.92 V6.16 33.27,90.22 33.27,91.75 33.58,92.05 v36.63,92.05 | v106.43,27.43 106.12,27.43 104.29,25.6 104.29,24.38 V4.14 | v119.53,27.43 122.28,24.69 122.28,24.38 121.97,24.08 V2.16 | v120.75,60.65 121.97,59.44 121.97,57.3 V3.16 | v127.46,56.08 127.46,57.61 123.8,61.27 v122.58,61.27 | v46.68,91.75 49.43,91.75 60.71,103.02 110.08,103.02 v118.92,94.18
-UB  (via drill 0.35)
  Top 0.305: 10.11,70.41 24.44,70.41 25.65,71.63 25.65,72.24 V6.8 | 10.11,70.41 8.59,70.41 7.67,71.32 7.67,72.24 V8.8 | 22.91,35.66 22.91,11.58 24.13,10.36 25.35,10.36 V9.7 | 22.91,35.66 25.35,38.1 25.35,39.32 V5.8 | 22.91,35.66 10.11,35.66 7.67,38.1 7.67,39.32 V7.8 7.37,39.62 6.45,39.62 5.23,40.84 5.23,45.11 6.15,46.02 6.45,45.72 9.5,45.72 10.11,46.33 10.11,70.41 | v109.47,64.62 v109.47,44.5 | v93.02,7.92 94.84,7.92 95.76,8.84 96.37,8.84 V4.7
  Bottom 0.305: 113.74,4.88 114.66,5.79 114.66,6.1 114.35,6.4 V2.8 | 113.74,4.88 113.44,4.57 99.72,4.57 96.67,7.62 96.67,8.84 V4.7 | v109.47,44.5 109.47,42.98 113.13,39.32 114.05,39.32 V3.8 | v109.47,64.62 109.47,66.45 111,67.97 | 111,67.97 114.66,71.63 114.66,71.93 114.35,72.24 V1.8 | 113.74,4.88 114.05,4.57 123.19,4.57 125.02,6.4 125.02,37.49 125.63,38.1 125.63,57 115.57,67.06 111.91,67.06 111,67.97 | v93.02,7.92 92.1,7.01 83.87,7.01 82.65,8.23 82.65,9.45 78.99,13.11 78.69,12.8 76.25,12.8 75.95,13.11 73.81,10.97 45.16,10.97 42.42,8.23 26.26,8.23 25.65,8.84 25.65,10.06 V9.7
CLK
  Bottom 0.305: V5.2 25.35,54.86 24.13,54.86 19.86,59.13 12.85,59.13 8.59,54.86 7.67,54.86 V7.2 7.37,54.56 6.45,54.56 5.23,55.78 5.23,86.26 6.45,87.48 7.37,87.48 V8.2 7.67,87.78 9.2,87.78 10.41,89 10.41,92.05 | 10.41,92.05 10.41,98.76 11.33,99.67 11.33,100.28 JP5.1 | 10.41,92.05 20.47,92.05 24.74,87.78 25.35,87.78 V6.2
CONTROL  (via drill 0.35)
  Top 0.305: 47.6,92.05 47.6,97.84 46.68,98.76 46.68,99.97 46.99,100.28 JP6.1 | 47.6,92.05 47.6,90.22 50.04,87.78 50.65,87.78 IC8.19 | 47.6,92.05 61.01,92.05 63.14,89.92 64.36,89.92 66.5,87.78 67.11,87.78 IC7.19 | v45.16,32.92 45.47,32.61 45.77,32.92 47.9,32.92 51.56,36.58 v51.56,49.68 | v49.12,52.43 54.61,57.91 v54.61,64.62
  Bottom 0.305: IC10.1 8.89,26.52 10.41,28.04 42.11,28.04 | 42.11,28.04 44.55,28.04 45.77,26.82 46.99,26.82 IC1.27 | IC9.19 85.09,87.78 83.57,87.78 79.3,92.05 72.29,92.05 68.02,87.78 67.41,87.78 IC7.19 | 42.11,28.04 42.11,32.31 42.72,32.92 v45.16,32.92 | v51.56,49.68 49.43,51.82 49.43,52.12 v49.12,52.43 | v54.61,64.62 54.61,84.43 51.56,87.48 50.95,87.48 IC8.19
COUNT
  Top 0.305: 12.85,43.28 9.5,43.28 8.28,42.06 7.67,42.06 V7.7 | 12.85,43.28 14.07,42.06 14.99,42.06 V7.10 15.29,42.06 15.9,42.06 17.12,43.28 22.91,43.28 24.13,42.06 25.35,42.06 V5.7 25.65,42.06 26.87,42.06 27.48,42.67 31.14,42.67 31.75,42.06 32.97,42.06 V5.10 | V8.10 15.29,74.98 15.9,74.98 17.12,76.2 22.91,76.2 24.13,74.98 25.35,74.98 V6.7 25.65,74.68 26.57,74.68 27.79,73.46 27.79,71.63 26.57,70.41 25.35,70.41 12.85,57.91 12.85,43.28
  Bottom 0.305: V8.7 7.67,74.98 8.28,74.98 9.5,76.2 12.85,76.2 14.07,74.98 14.99,74.98 V8.10 | V6.7 25.65,74.98 25.96,74.98 27.18,76.2 30.53,76.2 31.75,74.98 32.97,74.98 V6.10 33.27,74.68 35.41,76.81 35.41,85.34 | 35.41,85.34 35.41,85.65 | JP6.2 49.43,100.28 49.43,99.67 49.43,99.21 48.51,98.3 42.72,98.3 38.91,94.49 38.91,88.85 35.41,85.34
D_SIGNAL  (via drill 0.35)
  Top 0.305: v135.38,28.65 144.53,19.51 144.53,19.2 R5.2 | v112.22,67.97 106.43,73.76 102.77,73.76 102.46,74.07 v102.16,73.76 | v101.24,80.16 96.67,80.16 IC4.5
  Bottom 0.305: v135.38,28.65 135.38,50.6 118.01,67.97 v112.22,67.97 | v102.16,73.76 101.24,74.68 v101.24,80.16
GND  (34 unrouted)
  pour Top: -2.54,107.95 158.75,107.95 158.75,-1.27 -2.54,-1.27
  pour Bottom: -7.62,109.22 160.02,109.22 160.02,-2.54 -7.62,-2.54
HSYNC  (via drill 0.35)
  Top 0.305: LED2.A 52.17,12.5 52.48,12.5 55.22,9.75 55.22,8.23 56.44,7.01 64.67,7.01 75.34,17.68 78.69,17.68 78.99,17.37 79.3,17.68 80.82,17.68 83.26,15.24 86.31,15.24 86.61,15.54 89.36,12.8 94.54,12.8 95.76,11.58 96.37,11.58 V4.6 | v111.91,6.71 111.91,7.01 112.83,7.92 113.13,7.62 115.57,7.62 116.79,8.84 116.79,17.37 120.14,20.73 120.45,20.73 120.75,20.42 123.19,20.42 123.5,20.73 134.47,9.75 145.75,9.75 148.49,12.5 148.49,42.37 146.66,44.2 J1.13
  Bottom 0.305: v111.91,6.71 101.85,6.71 97.28,11.28 96.67,11.28 V4.6
N$1
  Top 0.305: IC2.9 144.78,77.47 Q1.2 148.44,78.59 150.98,78.59 C2.1
N$3
  Top 0.305: R1.1 149.32,77.47 147.03,75.18 145.07,75.18 143.9,76.35 138.58,76.35 137.92,77.01 137.92,77.93 138.58,78.59 143.36,78.59 Q1.1
N$4
  Bottom 0.305: V1.2 114.35,87.78 114.96,87.78 119.23,92.05 133.25,92.05 137.21,88.09 137.21,81.99 139.04,80.16 139.65,80.16 IC2.10
N$5
  Bottom 0.305: V1.9 121.97,72.54 122.58,72.54 129.59,79.55 129.59,85.65 131.42,87.48 132.03,87.48 IC2.2
N$6
  Top 0.305: 110.39,64.92 104.29,71.02 104.29,72.24 IC4.9 | 110.39,64.92 117.4,57.91 117.4,45.11 120.45,42.06 121.67,42.06 V3.10 | 110.39,64.92 116.79,71.32 116.79,76.2 120.45,79.86 121.67,79.86 V1.12
N$7
  Bottom 0.305: V1.15 121.97,87.78 122.58,87.78 124.1,89.31 130.2,89.31 130.81,89.92 132.03,89.92 IC2.1
N$8
  Bottom 0.305: IC5.18 104.29,52.12 104.9,52.12 111.91,59.13 115.57,59.13 119.53,55.17 119.53,40.84 120.75,39.62 121.67,39.62 V3.9
N$9
  Bottom 0.305: IC5.17 104.29,49.38 104.9,49.38 108.26,46.02 112.83,46.02 113.13,45.72 115.57,45.72 116.18,45.11 116.48,45.11 116.79,44.81 116.79,43.89 114.96,42.06 114.35,42.06 V3.7
N$10  (via drill 0.35)
  Top 0.305: v101.24,24.99 100.94,25.3 98.5,25.3 97.59,24.38 96.67,24.38 V4.1
  Bottom 0.305: v101.24,24.99 101.24,39.62 103.38,41.76 103.99,41.76 IC5.14 104.29,41.76 104.9,41.76 109.17,37.49 115.57,37.49 117.4,39.32 117.4,49.68 115.27,51.82 114.35,51.82 V3.3
N$11
  Top 0.305: V4.5 96.67,14.02 96.67,16.46 V4.4 | IC5.12 104.29,36.58 105.21,36.58 106.12,35.66 113.74,35.66 116.79,38.71 116.79,47.55 114.96,49.38 114.35,49.38 V3.4
  Bottom 0.305: V4.4 96.67,16.76 97.59,16.76 101.24,20.42 105.51,20.42 105.82,20.73 106.12,20.42 107.34,21.64 107.34,27.74 101.85,33.22 101.85,35.36 103.07,36.58 103.99,36.58 IC5.12
N$12  (via drill 0.35)
  Top 0.305: v73.51,27.13 82.65,36.27 82.65,42.67 84.18,44.2 85.09,44.2 IC6.15 | V2.2 114.05,21.64 113.74,21.64 110.08,25.3 102.77,25.3 99.11,21.64 99.11,8.23 97.89,7.01 83.87,7.01 79.91,10.97 79.91,12.19 78.38,13.72 77.47,13.72 IC3.5
  Bottom 0.305: v73.51,27.13 73.51,17.37 76.86,14.02 77.47,14.02 IC3.5 | V3.1 114.05,57 112.83,57 106.73,50.9 102.77,50.9 102.46,51.21 102.16,50.9 95.15,50.9 94.84,51.21 89.05,45.41 87.22,45.41 86.31,44.5 85.09,44.5 IC6.15
N$13  (via drill 0.35)
  Top 0.305: v93.02,30.79 88.44,30.79 83.26,25.6 83.26,20.42 84.48,19.2 85.09,19.2 IC3.12 | v100.33,30.79 101.85,30.79 103.99,32.92 103.99,34.14 IC5.11
  Bottom 0.305: v100.33,30.79 v93.02,30.79 | V3.13 121.97,49.38 122.58,49.38 124.41,47.55 124.41,38.71 123.19,37.49 117.4,37.49 112.22,32.31 104.9,32.31 104.29,32.92 104.29,34.14 IC5.11
N$14
  Top 0.305: V4.8 104.29,8.84 104.29,7.62 104.9,7.01 109.47,7.01 112.52,3.96 120.45,3.96 122.28,5.79 122.28,6.1 121.97,6.4 V2.9
N$15  (via drill 0.35)
  Top 0.305: v58.27,50.29 58.27,49.38 59.49,48.16 60.4,48.16 61.32,47.24 62.23,47.24 IC1.10
  Bottom 0.305: IC1.10 62.23,46.94 64.36,46.94 75.34,57.91 75.34,58.22 75.95,58.83 78.99,58.83 82.65,55.17 82.65,53.95 83.26,53.34 86.31,53.34 86.61,53.64 86.92,53.34 91.19,53.34 93.62,55.78 94.54,55.78 95.45,54.86 96.37,54.86 IC5.2 | v58.27,50.29 58.88,50.9 58.88,57.91 62.23,61.27 62.23,85.65 60.4,87.48 59.79,87.48 IC7.2
N$16
  Top 0.305: 106.12,15.24 106.73,15.85 106.73,17.07 104.9,18.9 104.29,18.9 V4.12 104.29,19.2 104.29,21.34 V4.13 | 106.12,15.24 104.9,14.02 104.29,14.02 V4.10 | 106.12,15.24 106.73,14.63 106.73,10.67 112.83,4.57 115.57,4.57 116.79,5.79 116.79,7.62 120.45,11.28 121.67,11.28 V2.11
  Bottom 0.305: IC3.2 77.47,21.64 78.08,21.64 82.35,25.91 99.11,25.91 103.38,21.64 103.99,21.64 V4.13
N$17  (via drill 0.35)
  Top 0.305: v123.5,60.35 121.97,60.35 119.53,57.91 | 119.53,57.91 119.53,48.46 120.75,47.24 121.67,47.24 V3.12 | v79.91,56.39 83.87,60.35 v108.56,60.35 | v116.48,60.35 117.09,60.35 119.53,57.91
  Bottom 0.305: v123.5,60.35 126.24,57.61 126.24,37.8 125.63,37.19 125.63,6.1 123.5,3.96 98.2,3.96 85.7,16.46 85.09,16.46 IC3.11 | v79.91,56.39 79.91,55.17 82.96,52.12 85.09,52.12 IC6.18 | v116.48,60.35 v108.56,60.35
N$18  (via drill 0.35)
  Top 0.305: v126.54,29.26 117.4,38.41 117.4,39.01 118.92,40.54 123.19,40.54 123.8,41.15 123.8,51.21 123.19,51.82 121.97,51.82 V3.14 | v82.65,56.69 82.65,50.6 83.57,49.68 85.09,49.68 IC6.17 | v108.56,62.18 v91.49,62.18
  Bottom 0.305: v126.54,29.26 126.54,6.1 123.8,3.35 97.89,3.35 97.28,3.96 85.4,3.96 78.08,11.28 77.47,11.28 IC3.6 | v82.65,56.69 82.65,57.91 86.92,62.18 v91.49,62.18 | v108.56,62.18 115.88,62.18 119.53,58.52 119.53,57 120.75,55.78 123.19,55.78 123.5,56.08 124.41,55.17 124.41,53.95 122.58,52.12 121.97,52.12 V3.14
N$19
  Top 0.305: V2.14 121.97,18.9 122.58,18.9 124.41,17.07 124.41,5.79 122.58,3.96 121.36,3.96 120.75,3.35 112.22,3.35 109.17,6.4 76.86,6.4 75.03,8.23 75.03,15.24 76.25,16.46 77.47,16.46 IC3.4
  Bottom 0.305: IC3.4 77.47,16.76 76.56,16.76 74.42,18.9 74.42,28.96 82.04,36.58 82.04,39.93 83.87,41.76 85.09,41.76 IC6.14
N$20
  Bottom 0.305: IC6.13 85.09,39.32 83.87,39.32 82.65,38.1 82.65,36.27 75.03,28.65 75.03,20.12 75.95,19.2 77.47,19.2 IC3.3 77.47,18.9 78.69,18.9 79.6,17.98 82.96,17.98 83.57,17.37 83.87,17.68 87.22,17.68 89.66,15.24 94.54,15.24 94.84,15.54 95.15,15.54 95.45,15.24 99.72,15.24 102.46,17.98 102.77,17.68 105.51,17.68 111.3,23.47 111.3,23.77 113.44,25.91 115.57,25.91 116.79,24.69 116.79,20.42 120.75,16.46 121.67,16.46 V2.13
N$21
  Top 0.305: IC2.5 132.03,79.86 131.42,79.86 125.02,73.46 125.02,56.69 123.19,54.86 121.97,54.86 V3.15
  Bottom 0.305: IC6.16 85.09,47.24 86,47.24 92.1,53.34 97.59,53.34 97.89,53.64 98.2,53.64 98.5,53.34 105.21,53.34 111.61,59.74 115.88,59.74 120.75,54.86 121.67,54.86 V3.15
N$22  (via drill 0.35)
  Top 0.305: v100.33,27.43 105.21,27.43 112.22,34.44 v119.84,34.44 | v121.97,36.58 123.19,36.58 126.54,39.93 126.54,56.39 129.29,59.13 v129.59,59.13
  Bottom 0.305: IC3.1 77.47,25.3 78.69,26.52 99.42,26.52 v100.33,27.43 | v121.97,36.58 v119.84,34.44 | v129.59,59.13 129.59,75.59 131.42,77.42 132.03,77.42 IC2.6
N$23  (via drill 0.35)
  Top 0.305: v82.65,17.07 82.65,28.65 88.14,34.14 88.14,49.99 87.53,50.6 87.53,51.21 95.15,58.83 v100.33,58.83
  Bottom 0.305: v82.65,17.07 82.65,10.67 84.18,9.14 85.09,9.14 IC3.8 | v100.33,58.83 100.33,65.23 107.34,72.24 107.34,89.31 110.69,92.66 133.55,92.66 138.43,87.78 139.65,87.78 IC2.13
N$24
  Top 0.305: IC4.11 104.29,77.72 105.21,77.72 111.91,84.43 111.91,90.83 113.13,92.05 115.57,92.05 119.53,88.09 119.53,86.56 120.75,85.34 121.67,85.34 V1.14
N$25
  Top 0.305: IC4.10 104.29,74.98 104.9,74.98 106.12,76.2 115.88,76.2 119.53,79.86 119.53,81.08 120.75,82.3 121.67,82.3 V1.13
N$26
  Bottom 0.305: IC5.16 104.29,46.94 104.9,46.94 106.43,45.41 112.22,45.41 113.13,44.5 114.05,44.5 V3.6
N$27
  Top 0.305: R5.1 144.53,11.58 144.53,11.89 141.78,14.63 141.78,15.24 T1.2
N$28
  Top 0.305: R3.2 45.77,9.14 45.77,9.45 48.82,12.5 49.43,12.5 LED2.K
N$29
  Top 0.305: R4.2 57.35,9.14 57.35,9.45 60.4,12.5 60.4,12.8 60.71,13.11 61.01,12.8 LED1.K
N$30
  Top 0.305: R1.2 144.78,69.85 139.95,74.68 IC2.8 138.89,75.74 138.32,75.74 137.31,76.76 137.31,79.86 139.7,82.25 IC2.11
N$35
  Top 0.305: IC5.15 104.29,44.2 105.21,44.2 106.12,43.28 109.47,43.28 113.13,46.94 114.05,46.94 V3.5
N$36  (via drill 0.35)
  Top 0.305: 62.23,44.5 61.62,44.5 57.66,48.46 57.66,49.68 57.35,49.99 v57.35,52.43 | v74.12,45.11 64.67,45.11 64.36,45.41 63.45,44.5 62.23,44.5 | 62.23,44.5 IC1.9
  Bottom 0.305: v57.35,52.43 57.35,65.53 57.05,65.84 57.05,83.21 58.88,85.04 59.49,85.04 IC7.3 | v74.12,45.11 74.42,45.41 75.34,45.41 75.64,45.11 76.25,45.72 83.26,45.72 83.57,46.02 83.87,45.72 86.31,45.72 86.61,46.02 87.22,46.02 93.32,52.12 96.37,52.12 IC5.3
N$37  (via drill 0.35)
  Top 0.305: 62.23,42.06 63.75,42.06 64.67,42.98 75.34,42.98 75.95,43.59 76.25,43.28 78.69,43.28 78.99,43.59 v79.3,43.28 | v56.13,79.86 58.57,82.3 59.49,82.3 IC7.4 | v56.44,51.82 56.44,51.51 56.74,51.21 56.74,49.68 57.05,49.38 57.05,46.02 61.01,42.06 62.23,42.06 | 62.23,42.06 IC1.8
  Bottom 0.305: v79.3,43.28 86.31,43.28 86.61,43.59 86.92,43.28 89.66,43.28 95.76,49.38 96.37,49.38 IC5.4 | v56.13,79.86 56.13,77.11 56.44,76.81 v56.44,51.82
N$38  (via drill 0.35)
  Top 0.305: v55.52,52.43 55.52,51.51 56.13,50.9 56.13,49.38 56.44,49.07 56.44,44.5 61.32,39.62 62.23,39.62 IC1.7 | v55.52,76.51 58.88,79.86 59.49,79.86 IC7.5 | v88.44,50.9 91.8,50.9 95.45,47.24 96.37,47.24 IC5.5 | v75.03,46.94 75.03,44.81 74.12,43.89 v67.41,43.89
  Bottom 0.305: v55.52,52.43 55.52,54.25 55.83,54.56 55.83,76.2 v55.52,76.51 | v88.44,50.9 83.87,50.9 83.57,51.21 80.52,48.16 76.25,48.16 v75.03,46.94 | v67.41,43.89 63.14,39.62 62.23,39.62 IC1.7
N$39  (via drill 0.35)
  Top 0.305: v100.03,20.42 100.03,17.37 v102.46,14.94 | v110.39,23.77 v110.39,21.34 | v124.1,57 124.41,57.3 124.41,74.68 129.59,79.86 129.59,81.08 130.81,82.3 132.03,82.3 IC2.4
  Bottom 0.305: v100.03,20.42 98.5,20.42 97.59,21.34 96.67,21.34 V4.2 | v102.46,14.94 102.77,14.94 103.07,15.24 105.21,15.24 105.51,15.54 105.82,15.54 106.12,15.24 110.39,19.51 v110.39,21.34 | v110.39,23.77 125.02,38.41 125.02,56.08 v124.1,57
N$40  (via drill 0.35)
  Top 0.305: v87.22,37.8 87.53,37.49 87.53,34.44 85.4,32.31 81.43,32.31 75.34,26.21 73.2,26.21 72.59,26.82 72.59,27.13 63.14,36.58 62.23,36.58 IC1.6 | v52.78,68.58 54.91,70.71 54.91,73.46 58.88,77.42 59.49,77.42 IC7.6 | v55.22,49.68 55.22,46.94 v55.52,46.63 | v68.33,39.32 v68.33,41.76
  Bottom 0.305: v87.22,37.8 89.05,37.8 95.45,44.2 96.37,44.2 IC5.6 | v52.78,68.58 53.09,68.28 53.09,52.43 52.78,52.12 52.78,51.51 54.61,49.68 v55.22,49.68 | v55.52,46.63 56.74,46.63 60.1,43.28 63.45,43.28 63.75,43.59 64.06,43.28 65.58,43.28 67.11,44.81 67.72,44.81 68.33,44.2 v68.33,41.76 | v68.33,39.32 68.02,39.32 66.19,37.49 64.06,37.49 63.45,36.88 62.23,36.88 IC1.6
N$41  (via drill 0.35)
  Top 0.305: v99.11,27.43 100.03,26.52 121.97,26.52 v122.28,26.82
  Bottom 0.305: V4.9 104.29,11.28 104.9,11.28 108.56,7.62 115.57,7.62 115.88,7.92 116.18,7.62 119.53,10.97 119.53,12.5 120.75,13.72 121.67,13.72 V2.12 121.97,14.02 122.58,14.02 124.41,15.85 124.41,24.69 v122.28,26.82 | v99.11,27.43 95.15,27.43 86,36.58 85.09,36.58 IC6.12
N$42  (via drill 0.35)
  Top 0.305: v49.73,37.19 48.82,38.1 45.77,38.1 45.47,38.41 45.16,38.1 44.55,38.71 44.55,57.91 57.05,70.41 57.05,73.15 58.57,74.68 59.49,74.68 IC7.7 | v83.57,28.35 88.75,33.53 88.75,36.58 94.23,42.06 96.37,42.06 IC5.7 | v75.95,22.86 73.81,22.86 72.29,21.34 v61.93,21.34
  Bottom 0.305: 60.1,35.05 59.49,35.66 51.26,35.66 v49.73,37.19 | 60.1,35.05 60.71,34.44 62.23,34.44 IC1.5 | v83.57,28.35 79.3,28.35 75.64,24.69 75.64,23.16 v75.95,22.86 | v61.93,21.34 59.79,23.47 59.79,34.75 60.1,35.05
N$43  (via drill 0.35)
  Top 0.305: v56.74,36.58 61.32,32 62.23,32 IC1.4 | v54.91,37.19 54.91,46.02 54.3,46.63 54.3,50.29 v54.91,50.9 | v66.19,35.05 70.76,35.05 76.25,40.54 78.38,40.54 80.21,42.37 80.21,55.47 84.48,59.74 104.9,59.74 106.73,57.91 106.73,46.33 106.12,45.72 105.82,46.02 105.51,46.02 105.21,45.72 103.07,45.72 102.77,46.02 102.46,46.02 101.55,45.11 101.55,43.59 97.59,39.62 96.67,39.62 IC5.8
  Bottom 0.305: v56.74,36.58 55.52,36.58 v54.91,37.19 | v54.91,50.9 57.05,50.9 58.27,52.12 58.27,65.53 57.66,66.14 57.66,71.02 58.88,72.24 59.49,72.24 IC7.8 | v66.19,35.05 63.14,32 62.23,32 IC1.4
N$44  (via drill 0.35)
  Top 0.305: v118.31,38.71 119.53,37.49 123.19,37.49 124.41,38.71 124.41,55.17 134.47,65.23 134.47,83.21 132.64,85.04 132.33,85.04 IC2.3
  Bottom 0.305: 118.01,39.01 115.88,36.88 107.34,36.88 104.9,39.32 104.29,39.32 IC5.13 | 118.01,39.01 118.01,51.51 114.96,54.56 114.35,54.56 V3.2 | 118.01,39.01 v118.31,38.71
N$45  (via drill 0.35)
  Top 0.305: v43.64,53.34 43.94,53.03 43.94,28.96 44.86,28.04 45.16,28.04 45.47,28.35 45.77,28.04 60.4,28.04 61.32,28.96 62.23,28.96 IC1.3 | v45.47,56.08 45.47,56.39 45.16,56.69 45.16,57.61 56.13,68.58 57.66,68.58 58.88,69.8 59.49,69.8 IC7.9 | v87.22,40.84 87.53,41.15 87.53,45.11 86.92,45.72 83.87,45.72 83.57,46.02 82.04,44.5 82.04,36.58 77.78,32.31 68.63,32.31 v68.33,32.61
  Bottom 0.305: v43.64,53.34 44.55,54.25 44.55,54.56 45.47,55.47 45.16,55.78 v45.47,56.08 | v87.22,40.84 89.66,40.84 94.84,46.02 95.15,46.02 95.45,45.72 97.59,45.72 97.89,46.02 98.2,46.02 99.11,45.11 99.11,38.71 97.28,36.88 96.67,36.88 IC5.9 | v68.33,32.61 66.8,32.61 63.45,29.26 62.23,29.26 IC1.3
N$46  (via drill 0.35)
  Top 0.305: v53.7,51.82 53.7,37.8 47.9,32 46.99,32 IC1.25 | v46.68,84.73 43.94,87.48 43.33,87.48 IC8.2 | v65.58,51.82 74.12,51.82 76.86,54.56 77.47,54.56 IC6.2 | v60.71,55.78 55.83,55.78 v54.91,54.86
  Bottom 0.305: 53.7,54.86 53.7,82.91 52.48,84.12 52.17,84.12 51.87,83.82 49.73,83.82 49.43,84.12 49.12,84.12 48.82,83.82 47.6,83.82 v46.68,84.73 | 53.7,54.86 v53.7,51.82 | v65.58,51.82 64.67,50.9 61.01,50.9 60.4,51.51 60.4,55.47 v60.71,55.78 | 53.7,54.86 v54.91,54.86
N$47  (via drill 0.35)
  Top 0.305: v80.52,41.45 80.52,41.76 80.82,42.06 80.82,49.68 v81.13,49.99 | v39.37,79.55 v39.37,82.91 | v39.98,59.74 39.98,50.29 39.67,49.99 39.67,49.07 v39.98,48.77 | v39.67,39.32 42.42,36.58 v42.42,34.75
  Bottom 0.305: v80.52,41.45 80.52,39.32 79.3,38.1 78.99,38.41 78.69,38.1 76.25,38.1 75.64,37.49 75.64,35.97 74.12,34.44 74.12,32.31 62.23,20.42 61.62,20.42 59.18,22.86 59.18,23.47 48.51,34.14 46.99,34.14 IC1.24 46.99,34.44 45.77,34.44 45.47,34.75 v42.42,34.75 | v81.13,49.99 80.21,49.99 78.38,51.82 77.47,51.82 IC6.3 | v39.37,82.91 40.59,84.12 41.5,84.12 42.42,85.04 43.03,85.04 IC8.3 | v39.37,79.55 39.37,71.02 39.98,70.41 v39.98,59.74 | v39.98,48.77 39.98,39.62 v39.67,39.32
N$48  (via drill 0.35)
  Top 0.305: v39.06,58.83 39.06,48.46 42.72,44.81 v43.03,44.81
  Bottom 0.305: 46.99,42.06 47.6,42.06 53.09,47.55 58.57,47.55 60.4,45.72 63.45,45.72 63.75,46.02 64.06,45.72 72.59,45.72 76.25,49.38 77.47,49.38 IC6.4 | v39.06,58.83 39.06,60.05 39.37,60.35 39.37,70.1 38.46,71.02 38.46,79.86 39.06,80.47 40.28,80.47 42.11,82.3 43.03,82.3 IC8.4 | v43.03,44.81 45.77,42.06 46.99,42.06 | 46.99,42.06 IC1.21
N$49  (via drill 0.35)
  Top 0.305: v40.89,62.79 38.15,60.05 38.15,48.46 v43.03,43.59
  Bottom 0.305: 49.43,38.1 63.45,38.1 63.75,38.41 64.06,38.1 65.89,38.1 73.81,46.02 75.34,46.02 76.25,46.94 77.47,46.94 IC6.5 | 49.43,38.1 48.82,38.1 47.6,36.88 46.99,36.88 IC1.23 | v40.89,62.79 40.59,63.09 40.59,78.33 42.11,79.86 43.03,79.86 IC8.5 | v43.03,43.59 46.08,40.54 48.21,40.54 48.51,40.23 48.82,40.54 49.12,40.54 49.43,40.23 49.43,38.1
N$50  (via drill 0.35)
  Top 0.305: v45.77,67.97 45.77,66.45 40.89,61.57 40.89,49.99 v40.59,49.68 | v40.59,35.36 40.59,30.48 43.94,27.13 43.94,24.08 46.68,21.34 v50.34,21.34 | v55.22,26.21 60.71,26.21 61.01,26.52 62.23,26.52 IC1.2
  Bottom 0.305: IC1.2 62.23,26.82 63.75,26.82 74.42,37.49 74.42,42.06 76.56,44.2 77.47,44.2 IC6.6 | v45.77,67.97 45.77,75.59 43.94,77.42 43.33,77.42 IC8.6 | v40.59,49.68 40.59,49.38 40.89,49.07 40.89,47.85 40.59,47.55 v40.59,35.36 | v55.22,26.21 v50.34,21.34
N$51  (via drill 0.35)
  Top 0.305: IC1.26 46.99,29.26 47.6,29.26 54.61,36.27 55.22,36.27 57.05,38.1 63.45,38.1 63.75,38.41 64.06,38.1 72.59,38.1 76.25,41.76 77.47,41.76 IC6.7 | v43.03,32 43.33,32.31 43.33,36.88 37.54,42.67 37.54,70.1 42.11,74.68 43.03,74.68 IC8.7
  Bottom 0.305: v43.03,32 45.77,29.26 46.99,29.26 IC1.26
N$52  (via drill 0.35)
  Top 0.305: v41.5,47.24 41.5,61.27 46.68,66.45 46.68,69.49 43.94,72.24 43.33,72.24 IC8.8 | v41.5,36.27 41.5,30.48 44.55,27.43 44.55,25.91 45.47,24.99 45.77,25.3 48.21,25.3 48.51,24.99 48.82,25.3 60.4,25.3 61.32,24.38 62.23,24.38 IC1.1
  Bottom 0.305: IC1.1 62.23,24.38 63.14,24.38 75.03,36.27 75.03,38.1 76.25,39.32 77.47,39.32 IC6.8 | v41.5,47.24 41.5,43.59 41.2,43.28 41.2,36.58 v41.5,36.27
N$53  (via drill 0.35)
  Top 0.305: v30.68,41.76 30.68,14.48 32.36,12.8 32.97,12.8 V9.9
  Bottom 0.305: v30.68,41.76 30.68,45.26 32.36,46.94 32.97,46.94 V5.12 33.27,47.24 34.19,47.24 43.94,57 43.94,63.7 50.04,69.8 50.65,69.8 IC8.12
N$54
  Top 0.305: V9.10 32.36,15.24 30.53,17.07 30.53,18.9 31.75,20.12 32.97,20.12 V9.12 32.97,20.42 32.97,22.86 | 32.97,22.86 32.36,22.86 30.53,24.69 30.53,33.83 34.8,38.1 34.8,43.59 34.19,44.2 33.27,44.2 V5.11 | 32.97,22.86 V9.13
  Bottom 0.305: V5.11 33.27,44.5 33.58,44.5 44.55,55.47 44.55,59.74 50.95,66.14 50.95,67.06 IC8.11
N$55  (via drill 0.35)
  Top 0.305: v23.22,93.57 21.69,92.05 21.69,90.83 16.2,85.34 15.29,85.34 V8.14 | v36.63,93.57 43.64,100.58 43.94,100.58 46.38,103.02 57.66,103.02 69.85,90.83 69.85,86.87 68.33,85.34 67.41,85.34 IC7.18
  Bottom 0.305: v36.63,93.57 v23.22,93.57
N$56  (via drill 0.35)
  Top 0.305: v43.64,101.5 45.16,103.02 45.47,103.02 46.08,103.63 57.96,103.63 70.46,91.14 70.46,85.04 68.02,82.6 67.41,82.6 IC7.17
  Bottom 0.305: v43.64,101.5 38.3,96.16 38.3,89.46 34.8,85.95 34.8,84.43 34.19,83.82 31.14,83.82 30.84,83.52 27.48,83.52 26.87,84.12 26.57,83.82 17.12,83.82 15.9,82.6 15.29,82.6 V8.13
N$57  (via drill 0.35)
  Top 0.305: v13.16,71.32 12.85,71.63 12.85,78.94 13.77,79.86 14.99,79.86 V8.12 | v38.46,69.8 40.59,71.93 40.59,72.24 42.11,73.76 44.55,73.76 44.86,74.07 45.16,73.76 46.68,73.76 48.51,75.59 49.12,75.59 49.73,76.2 51.87,76.2 52.17,76.51 52.48,76.51 52.78,76.2 53.7,76.2 57.05,79.55 57.05,79.86 58.57,81.38 61.01,81.38 61.32,81.69 61.93,81.08 65.58,81.08 66.5,80.16 67.11,80.16 IC7.16
  Bottom 0.305: v13.16,71.32 14.68,69.8 v38.46,69.8
N$58  (via drill 0.35)
  Top 0.305: v23.22,96.01 v18.34,91.14 | v24.13,101.5 24.13,101.8 25.96,103.63 45.16,103.63 45.77,104.24 58.27,104.24 71.07,91.44 71.07,80.47 68.33,77.72 67.41,77.72 IC7.15
  Bottom 0.305: v18.34,91.14 18.03,91.44 13.46,91.44 12.85,90.83 12.85,78.64 14.07,77.42 14.99,77.42 V8.11 | v23.22,96.01 24.13,96.93 24.13,98.45 23.83,98.76 24.13,99.06 v24.13,101.5
N$59  (via drill 0.35)
  Top 0.305: v31.14,50.9 30.23,50.9 27.18,47.85 26.87,47.85 26.57,48.16 19.86,48.16 16.2,51.82 15.29,51.82 V7.14 | v42.42,59.74 48.21,65.53 48.21,70.41 48.82,71.02 52.17,71.02 52.48,71.32 52.78,71.32 54.3,72.85 54.3,74.07 57.35,77.11 57.35,77.42 58.57,78.64 61.01,78.64 61.32,78.94 64.06,76.2 65.28,76.2 66.5,74.98 67.11,74.98 IC7.14
  Bottom 0.305: v31.14,50.9 31.45,51.21 31.75,50.9 34.19,50.9 34.49,51.21 35.1,51.21 42.42,58.52 v42.42,59.74
N$60  (via drill 0.35)
  Top 0.305: v11.94,57 11.94,58.22 v22.61,68.89 | v31.14,68.89 31.14,71.02 30.84,71.32 30.84,80.16 32.05,81.38 34.19,81.38 34.49,81.69 34.8,81.69 35.1,81.38 36.32,81.38 v37.85,82.91 | v48.51,96.01 58.27,96.01 v63.45,90.83
  Bottom 0.305: v11.94,57 11.94,51.51 13.77,49.68 14.99,49.68 V7.13 | v31.14,68.89 v22.61,68.89 | v37.85,82.91 41.2,86.26 44.25,86.26 45.16,87.17 45.16,92.66 v48.51,96.01 | v63.45,90.83 63.45,83.21 64.67,81.99 64.67,74.37 66.5,72.54 67.11,72.54 IC7.13
N$61  (via drill 0.35)
  Top 0.305: v30.23,49.68 30.23,48.77 27.18,45.72 26.87,46.02 26.57,45.72 17.12,45.72 15.9,46.94 15.29,46.94 V7.12 | v41.5,71.32 v38.46,68.28 | v52.78,81.38 55.22,81.38 57.96,84.12 58.27,84.12 58.57,83.82 60.71,83.82 61.01,84.12 61.32,84.12 v63.45,81.99
  Bottom 0.305: v30.23,49.68 30.23,60.05 v38.46,68.28 | v41.5,71.32 41.2,71.63 41.2,78.03 41.81,78.64 44.55,78.64 44.86,78.94 45.16,78.94 47.6,81.38 52.17,81.38 52.48,81.69 v52.78,81.38 | v63.45,81.99 63.45,72.85 66.19,70.1 67.11,70.1 IC7.12
N$62  (via drill 0.35)
  Top 0.305: v39.06,42.37 41.5,42.37 v42.11,42.98 | v45.47,50.6 45.77,50.9 48.21,50.9 48.51,51.21 48.82,50.9 60.1,62.18 v60.1,64.62 | v61.32,68.89 61.62,68.58 65.28,68.58 66.5,67.36 67.11,67.36 IC7.11
  Bottom 0.305: v39.06,42.37 33.58,36.88 14.68,36.88 12.85,38.71 12.85,43.28 14.07,44.5 14.99,44.5 V7.11 | v42.11,42.98 42.11,46.63 44.55,49.07 44.55,50.29 45.16,50.9 v45.47,50.6 | v60.1,64.62 61.62,66.14 61.62,68.58 v61.32,68.89
N$63
  Top 0.305: V6.14 33.27,85.04 34.19,85.04 41.2,92.05 44.55,92.05 48.21,88.39 48.21,86.87 49.73,85.34 50.65,85.34 IC8.18
N$64
  Bottom 0.305: V5.13 33.27,49.68 34.49,49.68 43.33,58.52 43.33,64.31 48.21,69.19 48.21,70.41 50.04,72.24 50.65,72.24 IC8.13
N$65  (via drill 0.35)
  Top 0.305: v42.42,60.96 47.6,66.14 47.6,72.54 49.73,74.68 50.65,74.68 IC8.14
  Bottom 0.305: v42.42,60.96 33.58,52.12 33.27,52.12 V5.14
N$66
  Top 0.305: V6.11 33.27,77.42 33.58,77.42 34.8,76.2 44.25,76.2 44.55,76.51 44.86,76.51 45.16,76.2 48.82,76.2 50.04,77.42 50.65,77.42 IC8.15
N$67
  Top 0.305: V6.12 33.27,79.86 34.49,79.86 35.71,78.64 44.55,78.64 44.86,78.94 45.16,78.64 48.82,78.64 50.04,79.86 50.65,79.86 IC8.16
N$68
  Top 0.305: V6.13 33.27,82.6 33.58,82.6 34.8,83.82 44.25,83.82 44.55,84.12 44.86,84.12 45.16,83.82 48.82,83.82 50.04,82.6 50.65,82.6 IC8.17
N$71
  Top 0.305: 79.91,66.75 66.5,53.34 64.06,53.34 63.75,53.64 63.45,53.34 54,53.34 47.9,47.24 46.99,47.24 IC1.19 | 79.91,66.75 79.91,68.58 78.69,69.8 77.47,69.8 IC9.9 | 79.91,66.75 81.13,65.53 92.71,65.53 99.11,71.93 99.11,76.81 102.16,79.86 103.99,79.86 IC4.12
N$72
  Bottom 0.305: 79.91,65.53 79.91,73.15 78.38,74.68 77.47,74.68 IC9.7 | 79.91,65.53 79.91,64.01 63.75,47.85 63.45,48.16 51.56,48.16 47.9,51.82 46.99,51.82 IC1.17 | 79.91,65.53 86.61,65.53 87.53,66.45 87.53,69.19 94.84,76.51 95.15,76.51 95.45,76.2 97.59,76.2 97.89,75.9 98.2,75.9 100.33,78.03 100.33,81.99 103.38,85.04 103.99,85.04 IC4.14
N$73  (via drill 0.35)
  Top 0.305: v71.68,64.62 63.45,64.62 48.51,49.68 46.99,49.68 IC1.18 | v74.12,64.62 75.64,66.14 75.64,71.02 76.86,72.24 77.47,72.24 IC9.8 77.47,72.54 78.69,72.54 79.6,73.46 80.52,73.46 83.57,76.51 83.87,76.2 89.36,76.2 94.84,81.69 95.15,81.38 102.16,81.38 103.07,82.3 103.99,82.3 IC4.13
  Bottom 0.305: v74.12,64.62 v71.68,64.62
N$74  (via drill 0.35)
  Top 0.305: v59.18,49.68 60.71,51.21 61.01,50.9 63.45,50.9 63.75,51.21 64.06,50.9 64.36,50.9 64.67,51.21 v64.67,52.43 | IC4.15 103.99,87.48 103.38,87.48 99.72,83.82 95.45,83.82 95.15,83.52 94.23,83.52 93.93,83.21 89.05,83.21 87.22,81.38 83.87,81.38 83.57,81.69 80.52,78.64 79.3,78.64 78.38,77.72 77.47,77.72 IC9.6
  Bottom 0.305: v59.18,49.68 58.27,48.77 54.61,48.77 50.04,53.34 48.82,53.34 47.6,54.56 46.99,54.56 IC1.16 | v64.67,52.43 64.67,53.03 75.64,64.01 75.64,76.81 76.25,77.42 77.47,77.42 IC9.6
N$75
  Top 0.305: IC1.15 46.99,58.22 54.3,65.53 68.63,65.53 74.42,71.32 74.42,82.6 75.64,83.82 | 75.64,83.82 78.69,83.82 79.91,82.6 79.91,81.38 78.69,80.16 77.47,80.16 IC9.5 | 75.64,83.82 75.03,84.43 75.03,90.83 76.25,92.05 78.69,92.05 81.74,89 83.26,89 83.57,89.31 83.87,89 94.54,89 95.45,89.92 96.37,89.92 IC4.1
N$76
  Top 0.305: IC1.13 62.23,54.86 63.14,54.86 75.03,66.75 75.03,80.77 76.56,82.3 77.47,82.3 IC9.4
  Bottom 0.305: IC4.2 96.37,87.78 94.23,87.78 87.83,81.38 83.87,81.38 83.57,81.69 83.26,81.38 79.3,81.38 78.38,82.3 77.47,82.3 IC9.4
N$77
  Top 0.305: IC4.3 96.37,85.04 95.76,85.04 94.84,84.12 93.93,84.12 93.62,83.82 83.87,83.82 83.57,84.12 83.26,83.82 79.91,83.82 78.69,85.04 77.47,85.04 IC9.3
  Bottom 0.305: IC1.12 62.23,52.12 62.84,52.12 75.03,64.31 75.03,83.82 76.25,85.04 77.47,85.04 IC9.3
N$78  (via drill 0.35)
  Top 0.305: v93.32,84.73 88.75,84.73 87.22,86.26 83.87,86.26 83.57,85.95 82.96,86.56 79.6,86.56 78.69,87.48 77.47,87.48 IC9.2
  Bottom 0.305: IC1.11 62.23,49.68 60.71,49.68 59.79,50.6 59.79,57.91 67.41,65.53 68.63,65.53 74.42,71.32 74.42,85.65 76.25,87.48 77.47,87.48 IC9.2 | v93.32,84.73 93.62,84.73 95.76,82.6 96.37,82.6 IC4.4
SIGNAL
  Top 0.305: J1.3 141.17,44.2 141.17,45.11 141.48,45.41 141.17,45.72 141.17,46.33 J1.2 141.17,46.63 141.17,47.24 141.48,47.55 141.17,47.85 141.17,48.77 J1.1 | R6.1 135.99,11.58 135.99,11.89 137.21,13.11 138.12,13.11 139.04,14.02 139.65,14.02 T1.1
  Bottom 0.305: J1.3 140.87,43.89 140.26,43.89 137.82,41.45 137.82,15.24 139.04,14.02 139.65,14.02 T1.1
VCC  (via drill 0.35)
  Top 0.305: IC3.14 85.09,25.3 85.7,25.91 93.93,25.91 | 93.93,25.91 113.44,25.91 113.74,25.6 | 113.74,25.6 114.66,24.69 114.66,24.38 114.35,24.08 V2.1 | 113.74,25.6 114.05,25.91 123.19,25.91 133.55,15.54 138.12,15.54 139.04,16.46 139.65,16.46 T1.3 | IC1.28 46.99,22.86 47.6,22.25 72.29,22.25 75.95,25.91 78.99,25.91 v81.74,23.16 | v101.24,61.27 v92.1,61.27 | IC9.20 85.09,91.44 84.79,91.75 | 84.79,91.75 76.56,99.97 72.9,99.97 72.59,100.28 JP4.2 | 84.79,91.75 85.09,92.05 103.38,92.05 103.99,91.44 103.99,90.22 IC4.16 | v110.39,91.14 110.39,92.35 v109.78,92.96 | 93.93,25.91 93.93,39.93 94.54,40.54 97.59,40.54 100.94,43.89 100.94,54.56 103.38,57 103.99,57 IC5.20
  Bottom 0.305: IC10.14 16.51,26.52 17.42,27.43 43.03,27.43 46.08,24.38 46.99,24.38 IC1.28 | v81.74,23.16 82.96,23.16 83.87,24.08 85.09,24.08 IC3.14 | IC6.20 85.09,58.22 88.14,61.27 v92.1,61.27 | IC5.20 103.99,57.3 103.99,58.52 v101.24,61.27 108.56,68.58 108.56,85.65 112.22,89.31 | 112.22,89.31 113.13,90.22 114.05,90.22 V1.1 | 66.5,92.05 51.56,92.05 50.95,91.44 50.95,90.22 IC8.20 | 66.5,92.05 67.72,90.83 67.72,90.53 67.41,90.22 IC7.20 | 109.78,93.27 106.12,93.27 104.29,91.44 104.29,90.22 IC4.16 | 109.78,93.27 137.82,93.27 139.65,91.44 139.65,90.22 IC2.14 | 66.5,92.05 66.5,93.57 72.29,99.37 72.29,100.28 JP4.2 | v110.39,91.14 112.22,89.31 | 109.78,93.27 v109.78,92.96
VSYNC  (via drill 0.35)
  Top 0.305: v80.52,22.86 80.52,21.34 79.6,20.42 79.3,20.42 78.99,20.73 78.69,20.42 71.68,20.42 64.06,12.8 63.75,12.8 LED1.A | v101.24,22.55 102.77,22.55 103.07,22.86 105.21,22.86 105.51,23.16 105.82,23.16 108.56,20.42 112.52,20.42 112.83,20.73 113.13,20.42 115.57,20.42 115.88,20.73 116.18,20.42 117.7,21.95 v117.7,24.99 | v124.1,27.43 132.94,27.43 143.31,37.8 146.96,37.8 147.88,38.71 147.88,40.54 146.66,41.76 146.05,41.76 J1.14
  Bottom 0.305: v80.52,22.86 80.52,23.16 82.65,25.3 98.5,25.3 v101.24,22.55 | v117.7,24.99 117.7,26.82 119.23,28.35 123.19,28.35 v124.1,27.43 | IC2.12 139.95,85.04 140.26,85.04 143.61,81.69 143.61,61.57 147.88,57.3 147.88,43.28 146.66,42.06 146.05,42.06 J1.14
|CLR  (via drill 0.35)
  Top 0.305: v14.99,96.32 8.89,90.22 7.67,90.22 V8.1 | v28.7,41.76 28.7,13.41 31.75,10.36 32.97,10.36 V9.8 | v6.15,93.88 6.15,93.57 4.01,91.44 4.01,78.94 5.23,77.72 5.23,60.65 7.98,57.91 7.98,57.61 7.67,57.3 V7.1
  Bottom 0.305: v14.99,96.32 18.64,92.66 24.13,92.66 25.35,91.44 25.35,90.22 V6.1 | v28.7,41.76 28.7,54.86 26.57,57 25.65,57 V5.1 25.65,57.3 25.65,57.91 23.83,59.74 9.2,59.74 7.67,58.22 7.67,57.3 V7.1 | v6.15,93.88 7.67,92.35 7.67,90.22 V8.1
|CONTROL  (via drill 0.35)
  Top 0.305: v75.03,33.22 75.03,37.49 75.95,38.41 76.25,38.1 79.3,38.1 81.43,40.23 81.43,46.63 82.96,48.16 83.26,48.16 83.57,47.85 83.87,48.16 86.31,48.16 86.61,47.85 87.53,48.77 87.53,49.68 86.92,50.29 86.92,50.9 86.61,51.21 87.53,52.12 87.53,52.73 85.7,54.56 85.09,54.56 IC6.19 | v41.5,26.52 41.5,28.35 v40.89,28.96
  Bottom 0.305: 93.02,58.83 99.11,58.83 103.07,54.86 103.99,54.86 IC5.19 | 93.02,58.83 89.97,58.83 86,54.86 85.09,54.86 IC6.19 | 93.02,58.83 93.02,72.24 95.45,74.68 96.37,74.68 IC4.7 | IC10.2 8.28,22.86 6.45,24.69 6.45,26.21 14.68,34.44 40.89,34.44 | 40.89,34.44 45.77,39.32 46.99,39.32 IC1.22 | v75.03,33.22 75.03,32.31 62.54,19.81 48.21,19.81 v41.5,26.52 | 40.89,34.44 v40.89,28.96

### Text on the board
tValues: HSYNC | VSYNC | GPU/Grafik İşlemci